# EAGLE design Breadboard (EAGLE 6.5.0)
AUTHOR: JP Liew; PRODUCT_NAME: STEMTera Breadboard; REV: V1.4
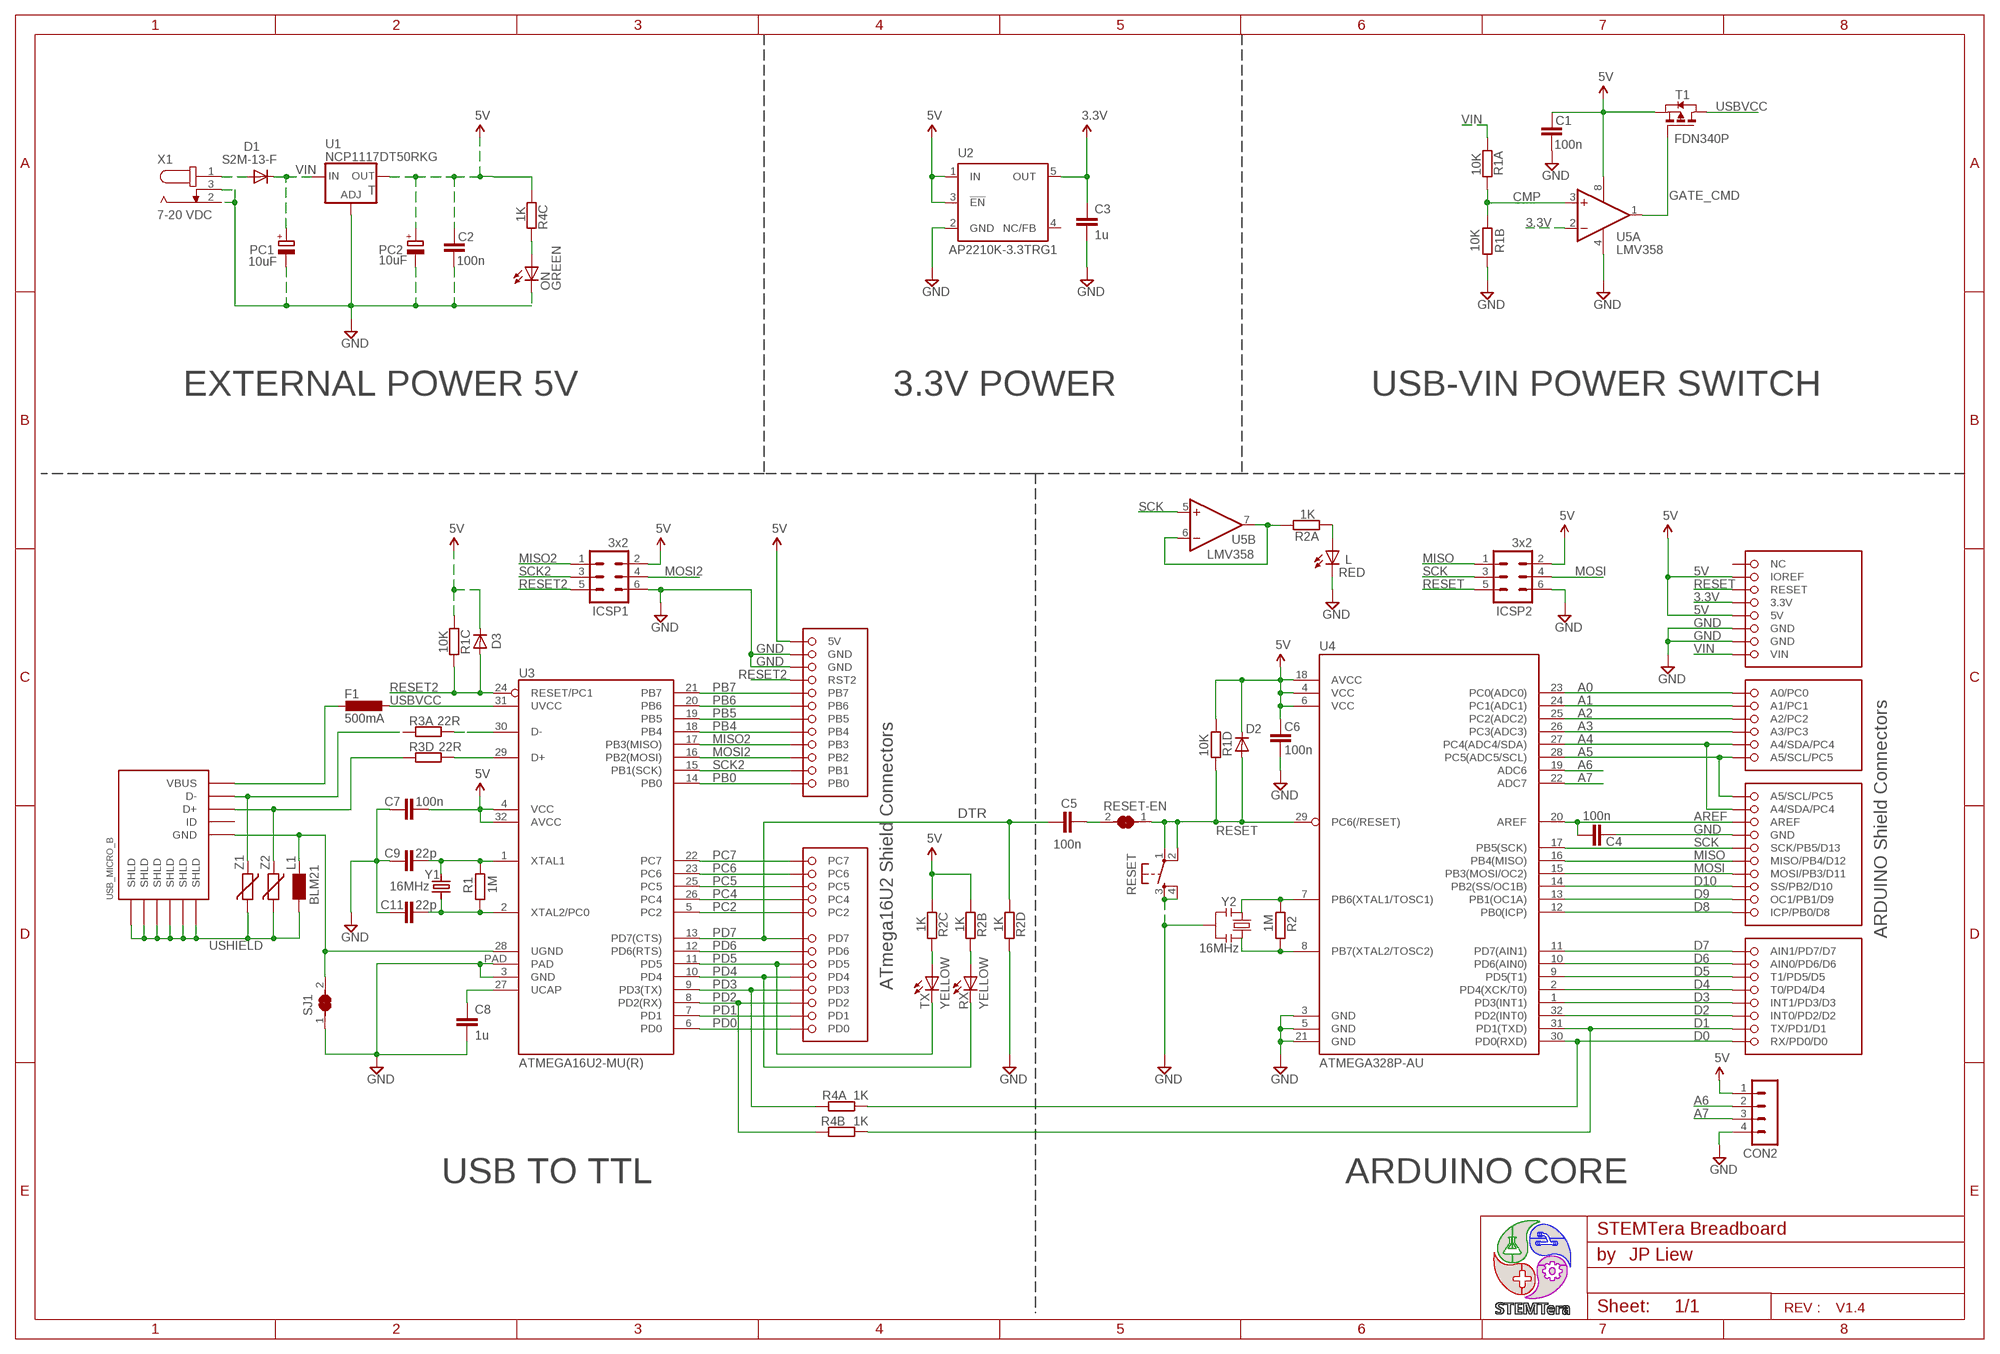
[diagram p0: schematic, sheet 1]

## Parts
C1  100n  C-EUC0603  [C0603]
C2  100n  C-EUC0603  [C0603]
C3  1u  C-EUC0603  [C0603]
C4  100n  C-EUC0603  [C0603]
C5  100n  C-EUC0603  [C0603]
C6  100n  C-EUC0603  [C0603]
C7  100n  C-EUC0603  [C0603]
C8  1u  C-EUC0603  [C0603]
C9  22p  C-EUC0603  [C0603]
C11  22p  C-EUC0603  [C0603]
CON1  STEMTERA  [STEMTERA]
CON2  MA04-1  [MA04-1-SMD]
D1  S2M-13-F  DIODE-SMB  [SMB]
D2  CD1206-S01575  DIODE-MINIMELF  [MINIMELF]
D3  CD1206-S01575  DIODE-MINIMELF  [MINIMELF]
F1  500mA  L-EUL1812  [L1812]
ICSP1  3x2  MA03-2  [MA03-2]
ICSP2  3x2  MA03-2  [MA03-2]
L  RED  LED3MM  [LED3MM]
L1  BLM21  WE-CBF-0805  [0805]
ON  GREEN  LED3MM  [LED3MM]
PC1  10uF  CAP_POL-CT6032  [CT6032]
PC2  10uF  CAP_POL-CT6032  [CT6032]
R1  1M  R-EU_R0603  [R0603]
R1A  10K  R-EU_R0603  [R0603]
R1B  10K  R-EU_R0603  [R0603]
R1C  10K  R-EU_R0603  [R0603]
R1D  10K  R-EU_R0603  [R0603]
R2  1M  R-EU_R0603  [R0603]
R2A  1K  R-EU_R0603  [R0603]
R2B  1K  R-EU_R0603  [R0603]
R2C  1K  R-EU_R0603  [R0603]
R2D  1K  R-EU_R0603  [R0603]
R3A  22R  R-EU_R0603  [R0603]
R3D  22R  R-EU_R0603  [R0603]
R4A  1K  R-EU_R0603  [R0603]
R4B  1K  R-EU_R0603  [R0603]
R4C  1K  R-EU_R0603  [R0603]
RESET  PUSH_BUTTON-ESWITCH_TL6120DF300QG  [PUSH_BUTTON-ESWITCH_TL6120DF300QG]
RESET-EN  Jumper  SOLDER_JUMPER_NC  [SOLDER_JUMPER_NC]
RX  YELLOW  LED3MM  [LED3MM]
SJ1  Jumper  SOLDER_JUMPER_NC  [SOLDER_JUMPER_NC]
T1  FDN340P  PMOSSOT23  [SOT-23]
TX  YELLOW  LED3MM  [LED3MM]
U1  NCP1117DT50RKG  LD117ADT-TR  [DPACK]
U2  AP2210K-3.3TRG1  TPS77001  [SOT23-DBV]
U3  ATMEGA16U2-MU(R)  ATMEGAXXU2-MU  [QFN32]
U4  ATMEGA328P-AU  ATMEGAXX8-32PIN  [TQFP32-7MM_0.8MM]
U5  LMV358  LM358-SO8  [SOIC08_3.8MM]
USB_MICRO_B  CONN_USB-FCI_10118193-0001LF  [CONN_USB_MICRO_B_10118193-0001LF]
X1  CONN_JACK-SINGLE_SIDED  [CONN_JACK_PJ-051A-SINGLE_SIDED]
Y1  16MHz  CRYSTAL-HC49US_2.5MM  [HC49US-SMD-2.5MM]
Y2  16MHz  RESONATORS-CSCTE_V  [CSTCE_V]
Z1  VARISTORCN0603  [CT/CN0603]
Z2  VARISTORCN0603  [CT/CN0603]

## Nets
3.3V: C3.1 CON1.3.3V U2.5(OUT) U5.2(A:-IN)
5V: C1.2 C2.2 C6.2 C7.2 CON1.5V CON1.5V@11(5V) CON1.IOREF CON2.1 D2.C D3.C ICSP1.2 ICSP2.2 PC2.+ R1C.2 R1D.2 R2B.2 R2C.2 R4C.2 T1.2(S) U1.4(OUT) U2.1(IN) U2.3(!EN) U3.4(VCC) U3.32(AVCC) U4.4(VCC) U4.6(VCC) U4.18(AVCC) U5.8(V+)
A0: CON1.A0(A0/PC0) U4.23(PC0(ADC0))
A1: CON1.A1(A1/PC1) U4.24(PC1(ADC1))
A2: CON1.A2(A2/PC2) U4.25(PC2(ADC2))
A3: CON1.A3(A3/PC3) U4.26(PC3(ADC3))
A4: CON1.A4@1(A4/SDA/PC4) CON1.A4@2(A4/SDA/PC4) U4.27(PC4(ADC4/SDA))
A5: CON1.A5@1(A5/SCL/PC5) CON1.A5@2(A5/SCL/PC5) U4.28(PC5(ADC5/SCL))
A6: CON2.2 U4.19(ADC6)
A7: CON2.3 U4.22(ADC7)
AREF: C4.2 CON1.AREF U4.20(AREF)
CMP: R1A.1 R1B.2 U5.3(A:+IN)
D0: CON1.D0(RX/PD0/D0) R4A.2 U4.30(PD0(RXD))
D1: CON1.D1(TX/PD1/D1) R4B.2 U4.31(PD1(TXD))
D2: CON1.D2(INT0/PD2/D2) U4.32(PD2(INT0))
D3: CON1.D3(INT1/PD3/D3) U4.1(PD3(INT1))
D4: CON1.D4(T0/PD4/D4) U4.2(PD4(XCK/T0))
D5: CON1.D5(T1/PD5/D5) U4.9(PD5(T1))
D6: CON1.D6(AIN0/PD6/D6) U4.10(PD6(AIN0))
D7: CON1.D7(AIN1/PD7/D7) U4.11(PD7(AIN1))
D8: CON1.D8(ICP/PB0/D8) U4.12(PB0(ICP))
D9: CON1.D9(OC1/PB1/D9) U4.13(PB1(OC1A))
D10: CON1.D10(SS/PB2/D10) U4.14(PB2(SS/OC1B))
GATE_CMD: T1.3(G) U5.1(A:OUT)
GND: C1.1 C2.1 C3.2 C4.1 C6.1 C7.1 C8.2 C9.1 C11.1 CON1.GND@1(GND) CON1.GND@2(GND) CON1.GND@3(GND) CON1.GND@11(GND) CON1.GND@12(GND) CON2.4 ICSP1.6 ICSP2.6 L.K(C) ON.K(C) PC1.- PC2.- R1B.1 R2D.1 RESET.3 RESET.4 SJ1.1 U1.1(ADJ) U2.2(GND) U3.3(GND) U3.PAD U4.3(GND) U4.5(GND) U4.21(GND) U5.4(V-) X1.2 X1.3 Y2.2
MISO: CON1.D12(MISO/PB4/D12) ICSP2.1 U4.16(PB4(MISO))
MISO2: CON1.PB3 ICSP1.1 U3.17(PB3(MISO))
MOSI: CON1.D11(MOSI/PB3/D11) ICSP2.4 U4.15(PB3(MOSI/OC2))
MOSI2: CON1.PB2 ICSP1.4 U3.16(PB2(MOSI))
N$1: R2.2 U4.7(PB6(XTAL1/TOSC1)) Y2.1
N$2: R3A.1 USB_MICRO_B.D- Z1.1
N$3: R3D.1 USB_MICRO_B.D+ Z2.1
N$4: C9.2 R1.2 U3.1(XTAL1) Y1.2
N$5: C8.1 U3.27(UCAP)
N$6: R3A.2 U3.30(D-)
N$7: C11.2 R1.1 U3.2(XTAL2/PC0) Y1.1
N$8: R3D.2 U3.29(D+)
N$9: R2.1 U4.8(PB7(XTAL2/TOSC2)) Y2.3
N$10: R2C.1 TX.A
N$11: R2B.1 RX.A
N$12: L.A R2A.2
N$13: D1.A X1.1
N$15: ON.A R4C.1
N$16: C5.2 RESET-EN.2
N$17: R2A.1 U5.6(B:-IN) U5.7(B:OUT)
PB0: CON1.PB0 U3.14(PB0)
PB4: CON1.PB4 U3.18(PB4)
PB5: CON1.PB5 U3.19(PB5)
PB6: CON1.PB6 U3.20(PB6)
PB7: CON1.PB7 U3.21(PB7)
PC2: CON1.PC2 U3.5(PC2)
PC4: CON1.PC4 U3.26(PC4)
PC5: CON1.PC5 U3.25(PC5)
PC6: CON1.PC6 U3.23(PC6)
PC7: CON1.PC7 U3.22(PC7)
PD0: CON1.PD0 U3.6(PD0)
PD1: CON1.PD1 U3.7(PD1)
PD2: CON1.PD2 R4B.1 U3.8(PD2(RX))
PD3: CON1.PD3 R4A.1 U3.9(PD3(TX))
PD4: CON1.PD4 RX.K(C) U3.10(PD4)
PD5: CON1.PD5 TX.K(C) U3.11(PD5)
PD6: CON1.PD6 U3.12(PD6(RTS))
PD7: C5.1 CON1.PD7 R2D.2 U3.13(PD7(CTS))
RESET: CON1.RESET D2.A ICSP2.5 R1D.1 RESET-EN.1 RESET.1 RESET.2 U4.29(PC6(/RESET))
RESET2: CON1.RST2 D3.A ICSP1.5 R1C.1 U3.24(RESET/PC1)
SCK: CON1.D13(SCK/PB5/D13) ICSP2.3 U4.17(PB5(SCK)) U5.5(B:+IN)
SCK2: CON1.PB1 ICSP1.3 U3.15(PB1(SCK))
UGND: L1.1 SJ1.2 U3.28(UGND) USB_MICRO_B.GND
USBVCC: F1.1 T1.1(D) U3.31(UVCC)
USHIELD: L1.2 USB_MICRO_B.SHLD@1(SHLD) USB_MICRO_B.SHLD@2(SHLD) USB_MICRO_B.SHLD@3(SHLD) USB_MICRO_B.SHLD@4(SHLD) USB_MICRO_B.SHLD@5(SHLD) USB_MICRO_B.SHLD@6(SHLD) Z1.2 Z2.2
VBUS: F1.2 USB_MICRO_B.VBUS
VIN: CON1.VIN D1.C PC1.+ R1A.2 U1.3(IN)
Unconnected: CON1.NC U2.4(NC/FB) USB_MICRO_B.ID

## Notes on the sheet
- 7-20 VDC
- EXTERNAL POWER 5V | 3.3V POWER | USB-VIN POWER SWITCH
- DTR
- ARDUINO Shield Connectors
- ATmega16U2 Shield Connectors
- USB TO TTL | ARDUINO CORE

## Library data of the parts
C1 C2 C4-C7 = rcl:C-EU: CAPACITOR, European symbol; DESCRIPTION: CAP CER 0.1UF 50V X7R 0603; MF: Yageo; MPN: CC0603KRX7R9BB104; OC_DIGIKEY: 311-1344-2-ND; URL: http://www.digikey.com/product-detail/en/CC0603KRX7R9BB104/311-1344-2-ND/2103082
C3 C8 = rcl:C-EU: CAPACITOR, European symbol; DESCRIPTION: CAP CER 1UF 10V X5R 0603; MF: Yageo; MPN: CC0603KRX5R6BB105; OC_DIGIKEY: 311-1443-2-ND; URL: http://www.digikey.com/product-detail/en/CC0603KRX5R6BB105/311-1443-2-ND/2833608
C9 C11 = rcl:C-EU: CAPACITOR, European symbol; DESCRIPTION: CAP CER 22PF 50V NP0 0603; MF: AVX; MPN: 06035A220JAT2A; OC_DIGIKEY: 478-1167-2-ND; URL: http://www.digikey.com/product-detail/en/06035A220JAT2A/478-1167-2-ND/563277
CON1 = SixthLogic:STEMTERA: STEMTera Layout; MF: NOT INSTALLED; MPN: NOT INSTALLED
CON2 = SixthLogic:MA04-1
D1 = diode:DIODE-: DIODE; DESCRIPTION: DIODE GEN PURP 1KV 1.5A SMB; MF: Diodes Inc; MPN: S2M-13-F; OC_DIGIKEY: S2M-FDITR-ND; URL: http://www.digikey.com/product-detail/en/S2M-13-F/S2M-FDITR-ND/749980
D2 D3 = diode:DIODE-: DIODE; DESCRIPTION: DIODE GEN PURP 100V 150MA 1206; MF: Bourns Inc; MPN: CD1206-S01575; OC_DIGIKEY: CD1206-S01575TR-ND; URL: http://www.digikey.com/product-detail/en/CD1206-S01575/CD1206-S01575TR-ND/3741981
F1 = rcl:L-EU: INDUCTOR, European symbol; DESCRIPTION: PTC RESETTABLE .50A 15V 1812; MF: Bourns Inc; MPN: MF-MSMF050-2; OC_DIGIKEY: MF-MSMF050-2TR-ND; URL: http://www.digikey.com/product-detail/en/MF-MSMF050-2/MF-MSMF050-2TR-ND/662816
ICSP1 = con-lstb:MA03-2: PIN HEADER; DESCRIPTION: ATmega16U2 ISP Conn; MF: NOT INSTALLED; MPN: NOT INSTALLED
ICSP2 = con-lstb:MA03-2: PIN HEADER; DESCRIPTION: ATmega328 ISP Conn; MF: NOT INSTALLED; MPN: NOT INSTALLED
L = led:LED: LED OSRAM: - CHIPLED LG R971, LG N971, LY N971, LG Q971, LY Q971, LO R971, LY R971 LH N974, LH R974 LS Q976, LO Q976, LY Q976 LO Q996 - Hyper CHIPLED LW Q18S LB Q993, LB Q99A, LB R99A - SideLED LS A670, LO A670, LY A670, LG A670, LP A670 LB A673, LV A673, LT A673, LW A673 LH A674 LY A675 LS A676, LA A676, LO A676, LY A676, LW A676 LS A679, LY A679, LG A679 - Hyper Micro SIDELED® LS Y876, LA Y876, LO Y876, LY Y876 LT Y87S - SmartLED LW L88C, LW L88S LB L89C, LB L89S, LG L890 LS L89K, LO L89K, LY L89K LS L896, LA L896, LO L896, LY L896 - TOPLED LS T670, LO T670, LY T670, LG T670, LP T670 LSG T670, LSP T670, LSY T670, LOP T670, LYG T670 LG T671, LOG T671, LSG T671 LB T673, LV T673, LT T673, LW T673 LH T674 LS T676, LA T676, LO T676, LY T676, LB T676, LH T676, LSB T676, LW T676 LB T67C, LV T67C, LT T67C, LS T67K, LO T67K, LY T67K, LW E67C LS E67B, LA E67B, LO E67B, LY E67B, LB E67C, LV E67C, LT E67C LW T67C LS T679, LY T679, LG T679 LS T770, LO T770, LY T770, LG T770, LP T770 LB T773, LV T773, LT T773, LW T773 LH T774 LS E675, LA E675, LY E675, LS T675 LS T776, LA T776, LO T776, LY T776, LB T776 LHGB T686 LT T68C, LB T68C - Hyper Mini TOPLED® LB M676 - Mini TOPLED Santana® LG M470 LS M47K, LO M47K, LY M47K Source: http://www.osram.convergy.de LUXEON: - LUMILED® LXK2-PW12-R00, LXK2-PW12-S00, LXK2-PW14-U00, LXK2-PW14-V00 LXK2-PM12-R00, LXK2-PM12-S00, LXK2-PM14-U00 LXK2-PE12-Q00, LXK2-PE12-R00, LXK2-PE12-S00, LXK2-PE14-T00, LXK2-PE14-U00 LXK2-PB12-K00, LXK2-PB12-L00, LXK2-PB12-M00, LXK2-PB14-N00, LXK2-PB14-P00, LXK2-PB14-Q00 LXK2-PR12-L00, LXK2-PR12-M00, LXK2-PR14-Q00, LXK2-PR14-R00 LXK2-PD12-Q00, LXK2-PD12-R00, LXK2-PD12-S00 LXK2-PH12-R00, LXK2-PH12-S00 LXK2-PL12-P00, LXK2-PL12-Q00, LXK2-PL12-R00 Source: www.luxeon.com KINGBRIGHT: KA-3528ASYC Source: www.kingbright.com; DESCRIPTION: LED, 2MM, RED, 8MCD, 617NM; MF: Kingbright; MPN: L-13ID; OC_NEWARK: 87W9950; URL: http://www.newark.com/kingbright/l-13id/led-2mm-red-8mcd-617nm/dp/87W9950?ost=l-13ID
L1 = SixthLogic:WE-CBF: SMD EMI Suppression Ferrite Beads - excellent anti-EMI properties - low DCR - impedances till 3000 ohms - rated current up to 6 A; DESCRIPTION: FERRITE CHIP 220 OHM 0805; MF: Murata; MPN: BLM21PG221SN1D; OC_DIGIKEY: 490-1054-2-ND; URL: http://www.digikey.com/product-detail/en/BLM21PG221SN1D/490-1054-2-ND/364909
ON = led:LED: LED OSRAM: - CHIPLED LG R971, LG N971, LY N971, LG Q971, LY Q971, LO R971, LY R971 LH N974, LH R974 LS Q976, LO Q976, LY Q976 LO Q996 - Hyper CHIPLED LW Q18S LB Q993, LB Q99A, LB R99A - SideLED LS A670, LO A670, LY A670, LG A670, LP A670 LB A673, LV A673, LT A673, LW A673 LH A674 LY A675 LS A676, LA A676, LO A676, LY A676, LW A676 LS A679, LY A679, LG A679 - Hyper Micro SIDELED® LS Y876, LA Y876, LO Y876, LY Y876 LT Y87S - SmartLED LW L88C, LW L88S LB L89C, LB L89S, LG L890 LS L89K, LO L89K, LY L89K LS L896, LA L896, LO L896, LY L896 - TOPLED LS T670, LO T670, LY T670, LG T670, LP T670 LSG T670, LSP T670, LSY T670, LOP T670, LYG T670 LG T671, LOG T671, LSG T671 LB T673, LV T673, LT T673, LW T673 LH T674 LS T676, LA T676, LO T676, LY T676, LB T676, LH T676, LSB T676, LW T676 LB T67C, LV T67C, LT T67C, LS T67K, LO T67K, LY T67K, LW E67C LS E67B, LA E67B, LO E67B, LY E67B, LB E67C, LV E67C, LT E67C LW T67C LS T679, LY T679, LG T679 LS T770, LO T770, LY T770, LG T770, LP T770 LB T773, LV T773, LT T773, LW T773 LH T774 LS E675, LA E675, LY E675, LS T675 LS T776, LA T776, LO T776, LY T776, LB T776 LHGB T686 LT T68C, LB T68C - Hyper Mini TOPLED® LB M676 - Mini TOPLED Santana® LG M470 LS M47K, LO M47K, LY M47K Source: http://www.osram.convergy.de LUXEON: - LUMILED® LXK2-PW12-R00, LXK2-PW12-S00, LXK2-PW14-U00, LXK2-PW14-V00 LXK2-PM12-R00, LXK2-PM12-S00, LXK2-PM14-U00 LXK2-PE12-Q00, LXK2-PE12-R00, LXK2-PE12-S00, LXK2-PE14-T00, LXK2-PE14-U00 LXK2-PB12-K00, LXK2-PB12-L00, LXK2-PB12-M00, LXK2-PB14-N00, LXK2-PB14-P00, LXK2-PB14-Q00 LXK2-PR12-L00, LXK2-PR12-M00, LXK2-PR14-Q00, LXK2-PR14-R00 LXK2-PD12-Q00, LXK2-PD12-R00, LXK2-PD12-S00 LXK2-PH12-R00, LXK2-PH12-S00 LXK2-PL12-P00, LXK2-PL12-Q00, LXK2-PL12-R00 Source: www.luxeon.com KINGBRIGHT: KA-3528ASYC Source: www.kingbright.com; DESCRIPTION: LED, GREEN, 2MM, 12MCD, 568NM; MF: Kingbright; MPN: L-13GD; OC_NEWARK: 85K7617; URL: http://www.newark.com/kingbright/l-13gd/led-green-2mm-12mcd-568nm/dp/85K7617?ost=l-13gd
PC1 PC2 = SixthLogic:CAP_POL: Capacitor with Polarity; DESCRIPTION: CAP TANT 10UF 25V 20%; MF: Kemet; MPN: T491C106M025AT7280; OC_DIGIKEY: 399-10160-2-ND; URL: http://www.digikey.com/product-detail/en/T491C106M025AT7280/399-10160-2-ND/3759639
R1 R2 = rcl:R-EU_: RESISTOR, European symbol; DESCRIPTION: RES SMD 1M OHM 1% 1/10W 0603; MF: Yageo; MPN: RC0603FR-071ML; OC_DIGIKEY: 311-1.00MHRTR-ND; URL: http://www.digikey.com/product-detail/en/RC0603FR-071ML/311-1.00MHRTR-ND/726844
R1A R1B R1C R1D = rcl:R-EU_: RESISTOR, European symbol; DESCRIPTION: RES SMD 10K OHM 1% 1/10W 0603; MF: Yageo; MPN: RC0603FR-0710KL; OC_DIGIKEY: 311-10.0KHRTR-ND; URL: http://www.digikey.com.au/product-detail/en/RC0603FR-0710KL/311-10.0KHRTR-ND/726880
R2A R2B R2C R2D R4A R4B R4C = rcl:R-EU_: RESISTOR, European symbol; DESCRIPTION: RES SMD 1K OHM 1% 1/10W 0603; MF: Yageo; MPN: RC0603FR-071KL; OC_DIGIKEY: 311-1.00KHRTR-ND; URL: http://www.digikey.com.au/product-detail/en/RC0603FR-071KL/311-1.00KHRTR-ND/726843
R3A R3D = rcl:R-EU_: RESISTOR, European symbol; DESCRIPTION: RES SMD 22 OHM 1% 1/10W 0603; MF: Yageo; MPN: RC0603FR-0722RL; OC_DIGIKEY: 311-22.0HRTR-ND; URL: http://www.digikey.com.au/product-detail/en/RC0603FR-0722RL/311-22.0HRTR-ND/727055
RESET = SixthLogic:PUSH_BUTTON: PUSH BUTTON; DESCRIPTION: SWITCH TACTILE SPST-NO 0.05A 50V; MF: E-Switch; MPN: TL6120DF300QG; OC_DIGIKEY: EG4356TR-ND; URL: http://www.digikey.com/product-detail/en/TL6120DF300QG/EG4356TR-ND/1137163
RESET-EN = SixthLogic:SOLDER_JUMPER_NC: Solder Jumper - Normally Closed; DESCRIPTION: RESET ENABLE PCB JUMPER; MF: NOT INSTALLED; MPN: NOT INSTALLED
RX = led:LED: LED OSRAM: - CHIPLED LG R971, LG N971, LY N971, LG Q971, LY Q971, LO R971, LY R971 LH N974, LH R974 LS Q976, LO Q976, LY Q976 LO Q996 - Hyper CHIPLED LW Q18S LB Q993, LB Q99A, LB R99A - SideLED LS A670, LO A670, LY A670, LG A670, LP A670 LB A673, LV A673, LT A673, LW A673 LH A674 LY A675 LS A676, LA A676, LO A676, LY A676, LW A676 LS A679, LY A679, LG A679 - Hyper Micro SIDELED® LS Y876, LA Y876, LO Y876, LY Y876 LT Y87S - SmartLED LW L88C, LW L88S LB L89C, LB L89S, LG L890 LS L89K, LO L89K, LY L89K LS L896, LA L896, LO L896, LY L896 - TOPLED LS T670, LO T670, LY T670, LG T670, LP T670 LSG T670, LSP T670, LSY T670, LOP T670, LYG T670 LG T671, LOG T671, LSG T671 LB T673, LV T673, LT T673, LW T673 LH T674 LS T676, LA T676, LO T676, LY T676, LB T676, LH T676, LSB T676, LW T676 LB T67C, LV T67C, LT T67C, LS T67K, LO T67K, LY T67K, LW E67C LS E67B, LA E67B, LO E67B, LY E67B, LB E67C, LV E67C, LT E67C LW T67C LS T679, LY T679, LG T679 LS T770, LO T770, LY T770, LG T770, LP T770 LB T773, LV T773, LT T773, LW T773 LH T774 LS E675, LA E675, LY E675, LS T675 LS T776, LA T776, LO T776, LY T776, LB T776 LHGB T686 LT T68C, LB T68C - Hyper Mini TOPLED® LB M676 - Mini TOPLED Santana® LG M470 LS M47K, LO M47K, LY M47K Source: http://www.osram.convergy.de LUXEON: - LUMILED® LXK2-PW12-R00, LXK2-PW12-S00, LXK2-PW14-U00, LXK2-PW14-V00 LXK2-PM12-R00, LXK2-PM12-S00, LXK2-PM14-U00 LXK2-PE12-Q00, LXK2-PE12-R00, LXK2-PE12-S00, LXK2-PE14-T00, LXK2-PE14-U00 LXK2-PB12-K00, LXK2-PB12-L00, LXK2-PB12-M00, LXK2-PB14-N00, LXK2-PB14-P00, LXK2-PB14-Q00 LXK2-PR12-L00, LXK2-PR12-M00, LXK2-PR14-Q00, LXK2-PR14-R00 LXK2-PD12-Q00, LXK2-PD12-R00, LXK2-PD12-S00 LXK2-PH12-R00, LXK2-PH12-S00 LXK2-PL12-P00, LXK2-PL12-Q00, LXK2-PL12-R00 Source: www.luxeon.com KINGBRIGHT: KA-3528ASYC Source: www.kingbright.com; DESCRIPTION: LED, 2MM, YELLOW, 8MCD, 588NM; MF: Kingbright; MPN: L-13YD; OC_NEWARK: 04M4239; URL: http://www.newark.com/kingbright/l-13yd/led-yellow-2mm-8mcd-590nm/dp/04M4239
SJ1 = SixthLogic:SOLDER_JUMPER_NC: Solder Jumper - Normally Closed; DESCRIPTION: USB SHIELD GROUND PCB JUMPER; MF: NOT INSTALLED; MPN: NOT INSTALLED
T1 = zetex:PMOSSOT23: MOS FET; DESCRIPTION: MOSFET P-CH 20V 2A SSOT3; MF: Fairchild; MPN: FDN340P; OC_DIGIKEY: FDN340PTR-ND; URL: http://www.digikey.com/product-detail/en/FDN340P/FDN340PTR-ND/965304
TX = led:LED: LED OSRAM: - CHIPLED LG R971, LG N971, LY N971, LG Q971, LY Q971, LO R971, LY R971 LH N974, LH R974 LS Q976, LO Q976, LY Q976 LO Q996 - Hyper CHIPLED LW Q18S LB Q993, LB Q99A, LB R99A - SideLED LS A670, LO A670, LY A670, LG A670, LP A670 LB A673, LV A673, LT A673, LW A673 LH A674 LY A675 LS A676, LA A676, LO A676, LY A676, LW A676 LS A679, LY A679, LG A679 - Hyper Micro SIDELED® LS Y876, LA Y876, LO Y876, LY Y876 LT Y87S - SmartLED LW L88C, LW L88S LB L89C, LB L89S, LG L890 LS L89K, LO L89K, LY L89K LS L896, LA L896, LO L896, LY L896 - TOPLED LS T670, LO T670, LY T670, LG T670, LP T670 LSG T670, LSP T670, LSY T670, LOP T670, LYG T670 LG T671, LOG T671, LSG T671 LB T673, LV T673, LT T673, LW T673 LH T674 LS T676, LA T676, LO T676, LY T676, LB T676, LH T676, LSB T676, LW T676 LB T67C, LV T67C, LT T67C, LS T67K, LO T67K, LY T67K, LW E67C LS E67B, LA E67B, LO E67B, LY E67B, LB E67C, LV E67C, LT E67C LW T67C LS T679, LY T679, LG T679 LS T770, LO T770, LY T770, LG T770, LP T770 LB T773, LV T773, LT T773, LW T773 LH T774 LS E675, LA E675, LY E675, LS T675 LS T776, LA T776, LO T776, LY T776, LB T776 LHGB T686 LT T68C, LB T68C - Hyper Mini TOPLED® LB M676 - Mini TOPLED Santana® LG M470 LS M47K, LO M47K, LY M47K Source: http://www.osram.convergy.de LUXEON: - LUMILED® LXK2-PW12-R00, LXK2-PW12-S00, LXK2-PW14-U00, LXK2-PW14-V00 LXK2-PM12-R00, LXK2-PM12-S00, LXK2-PM14-U00 LXK2-PE12-Q00, LXK2-PE12-R00, LXK2-PE12-S00, LXK2-PE14-T00, LXK2-PE14-U00 LXK2-PB12-K00, LXK2-PB12-L00, LXK2-PB12-M00, LXK2-PB14-N00, LXK2-PB14-P00, LXK2-PB14-Q00 LXK2-PR12-L00, LXK2-PR12-M00, LXK2-PR14-Q00, LXK2-PR14-R00 LXK2-PD12-Q00, LXK2-PD12-R00, LXK2-PD12-S00 LXK2-PH12-R00, LXK2-PH12-S00 LXK2-PL12-P00, LXK2-PL12-Q00, LXK2-PL12-R00 Source: www.luxeon.com KINGBRIGHT: KA-3528ASYC Source: www.kingbright.com; DESCRIPTION: LED, YELLOW, 2MM, 8MCD, 590NM; MF: Kingbright; MPN: L-13YD; OC_NEWARK: 04M4239; URL: http://www.newark.com/kingbright/l-13yd/led-yellow-2mm-8mcd-590nm/dp/04M4239
U1 = v-reg:LD117A?*: Low drop fixed and adjustable positive voltage regulators 1 A Source: http://www.st.com/stonline/products/literature/ds/7194/ld1117axx.pdf; DESCRIPTION: IC REG LDO 5V 1A DPAK; MF: ON Semiconductor; MPN: NCP1117DT50RKG; OC_DIGIKEY: NCP1117DT50RKGOSTR-ND; URL: http://www.digikey.com/product-detail/en/NCP1117DT50RKG/NCP1117DT50RKGOSTR-ND/661206
U2 = texas:TPS770*: ULTRALOW-POWER 50-mA LOW-DROPOUT LINEAR REGULATORS 50-mA Low-Dropout Regulator Source: http://focus.ti.com/lit/ds/symlink/tps77001.pdf; DESCRIPTION: IC REG LDO 3.3V 0.3A SOT25; MF: Diodes Inc; MPN: AP2210K-3.3TRG1; OC_DIGIKEY: AP2210K-3.3TRG1DITR-ND; URL: http://www.digikey.com/product-detail/en/AP2210K-3.3TRG1/AP2210K-3.3TRG1DITR-ND/4470819
U3 = SixthLogic:ATMEGAXXU2: ATmegaXXU2 8-bit Microcontroller with 8/16/32K Bytes of ISP Flash and USB Controller; DESCRIPTION: IC MCU 8BIT 16KB FLASH 32QFN; MF: Atmel; MPN: ATMEGA16U2-MU; OC_DIGIKEY: ATMEGA16U2-MU-ND; URL: http://www.digikey.com/product-detail/en/ATMEGA16U2-MU/ATMEGA16U2-MU-ND/2050821
U4 = SixthLogic:ATMEGAXX8-32PIN; DESCRIPTION: IC MCU 8BIT 32KB FLASH 32TQFP; MF: Atmel; MPN: ATmega328P-AUR; OC_DIGIKEY: ATMEGA328P-AURTR-ND; URL: http://www.digikey.com/product-detail/en/ATMEGA328P-AUR/ATMEGA328P-AURTR-ND/2357086
U5 = SixthLogic:LM358: LM358 OPAMP; DESCRIPTION: IC OPAMP GP 1MHZ RRO 8SOP; MF: Diodes Incorporated; MPN: LMV358SG-13; OC_DIGIKEY: LMV358SG-13DITR-ND; URL: http://www.digikey.com/product-detail/en/LMV358SG-13/LMV358SG-13DITR-ND/2182560
USB_MICRO_B = SixthLogic:CONN_USB: USB Connector; DESCRIPTION: Connector Receptacle USB - micro B 2.0 5 Position Surface Mount, Right Angle, Horizontal; MF: FCI; MPN: 10118193-0001LF; OC_DIGIKEY: 609-4616-2-ND; URL: http://www.digikey.com/product-detail/en/10118193-0001LF/609-4616-2-ND/2785388
X1 = SixthLogic:CONN_JACK: DC POWER JACK; DESCRIPTION: CON PWR JCK 2.0 X 6.0MM W/SHLD; MF: CUI Inc; MPN: PJ-051A; OC_DIGIKEY: CP-051A-ND; URL: http://www.digikey.com.au/product-detail/en/PJ-051A/CP-051A-ND/1644585
Y1 = SixthLogic:CRYSTAL: 2 pin Crystal; DESCRIPTION: Crystal 16.0000MHz 20ppm 18pF; MF: Abracon; MPN: ABLS3-16.000MHZ-D4Y-T; OC_DIGIKEY: 535-10856-2-ND; URL: https://www.digikey.com.au/product-detail/en/ABLS3-16.000MHZ-D4Y-T/535-10856-2-ND/2623698
Y2 = SixthLogic:RESONATORS: Ceramic Resonators; DESCRIPTION: CER RESONATOR 16.0MHZ SMD; MF: Murata; MPN: CSTCE16M0V53-R0; OC_DIGIKEY: 490-1198-2-ND; URL: http://www.digikey.com/product-detail/en/CSTCE16M0V53-R0/490-1198-2-ND/584406
Z1 Z2 = varistor:VARISTOR: VARISTOR; DESCRIPTION: VARISTOR 0603; MF: Bourns Inc; MPN: CG0603MLC-05E; OC_DIGIKEY: CG0603MLC-05ETR-ND; URL: http://www.digikey.com/product-detail/en/CG0603MLC-05E/CG0603MLC-05ETR-ND/2538084

## Board
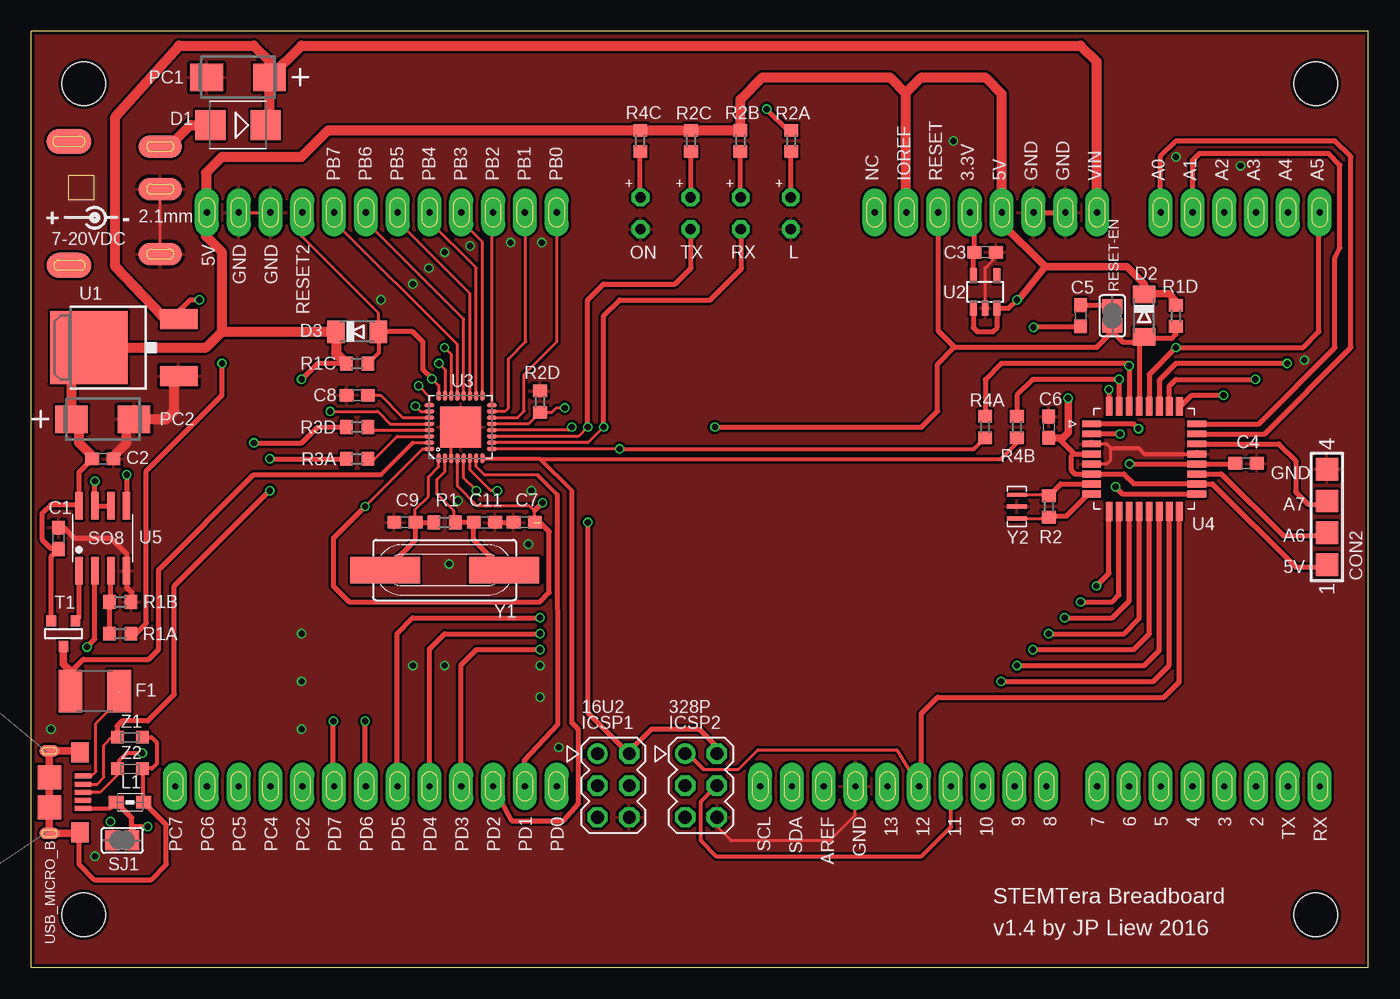
[diagram p1: board, top side]
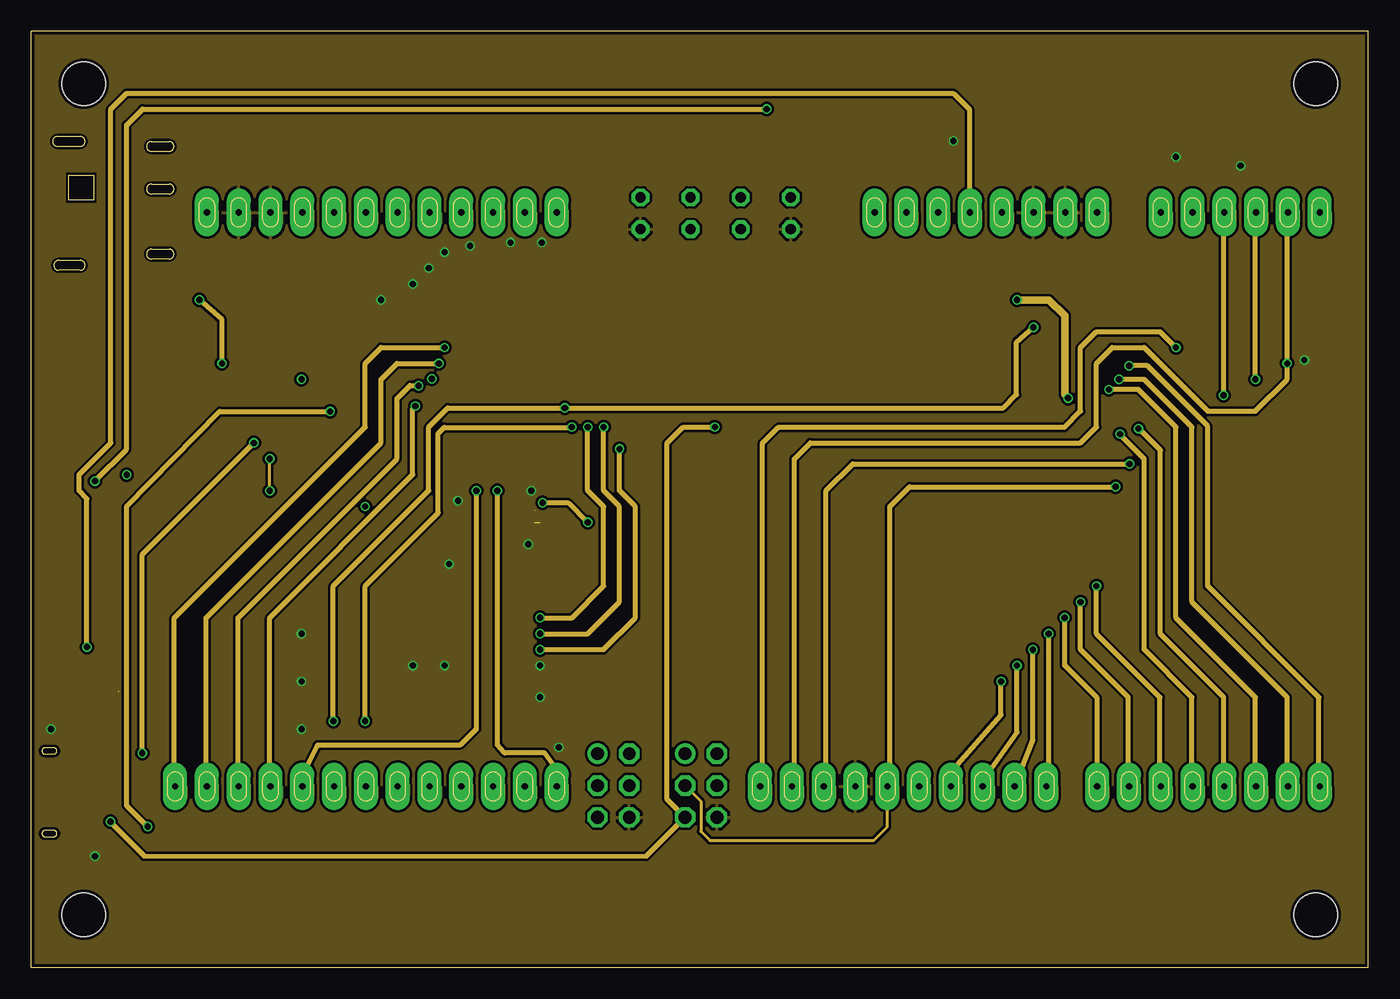
[diagram p2: board, inner layer Route2]
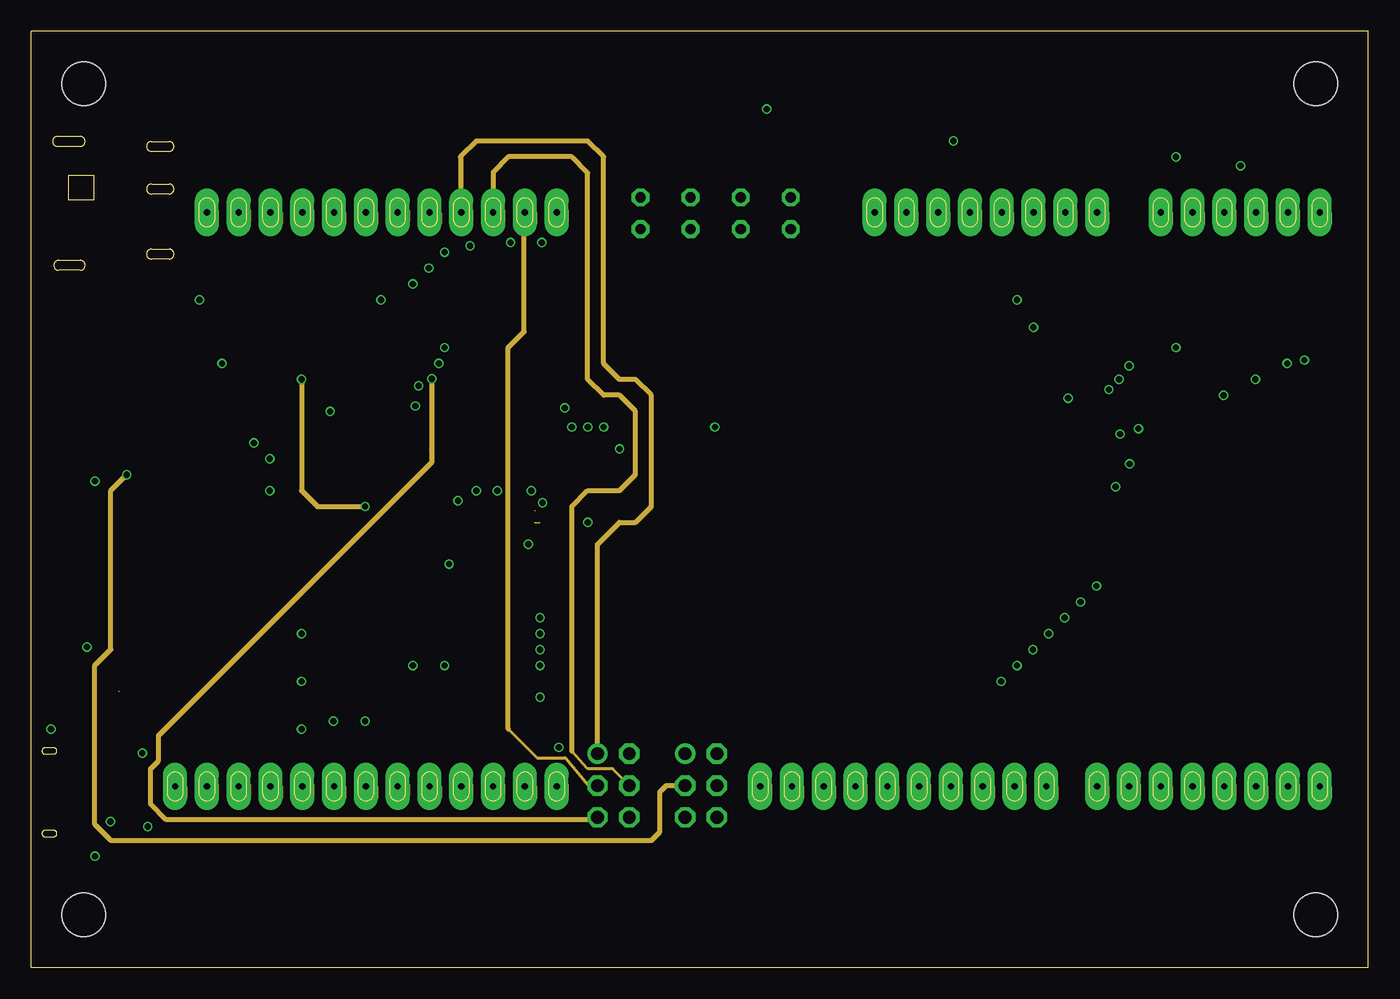
[diagram p3: board, inner layer Route3]
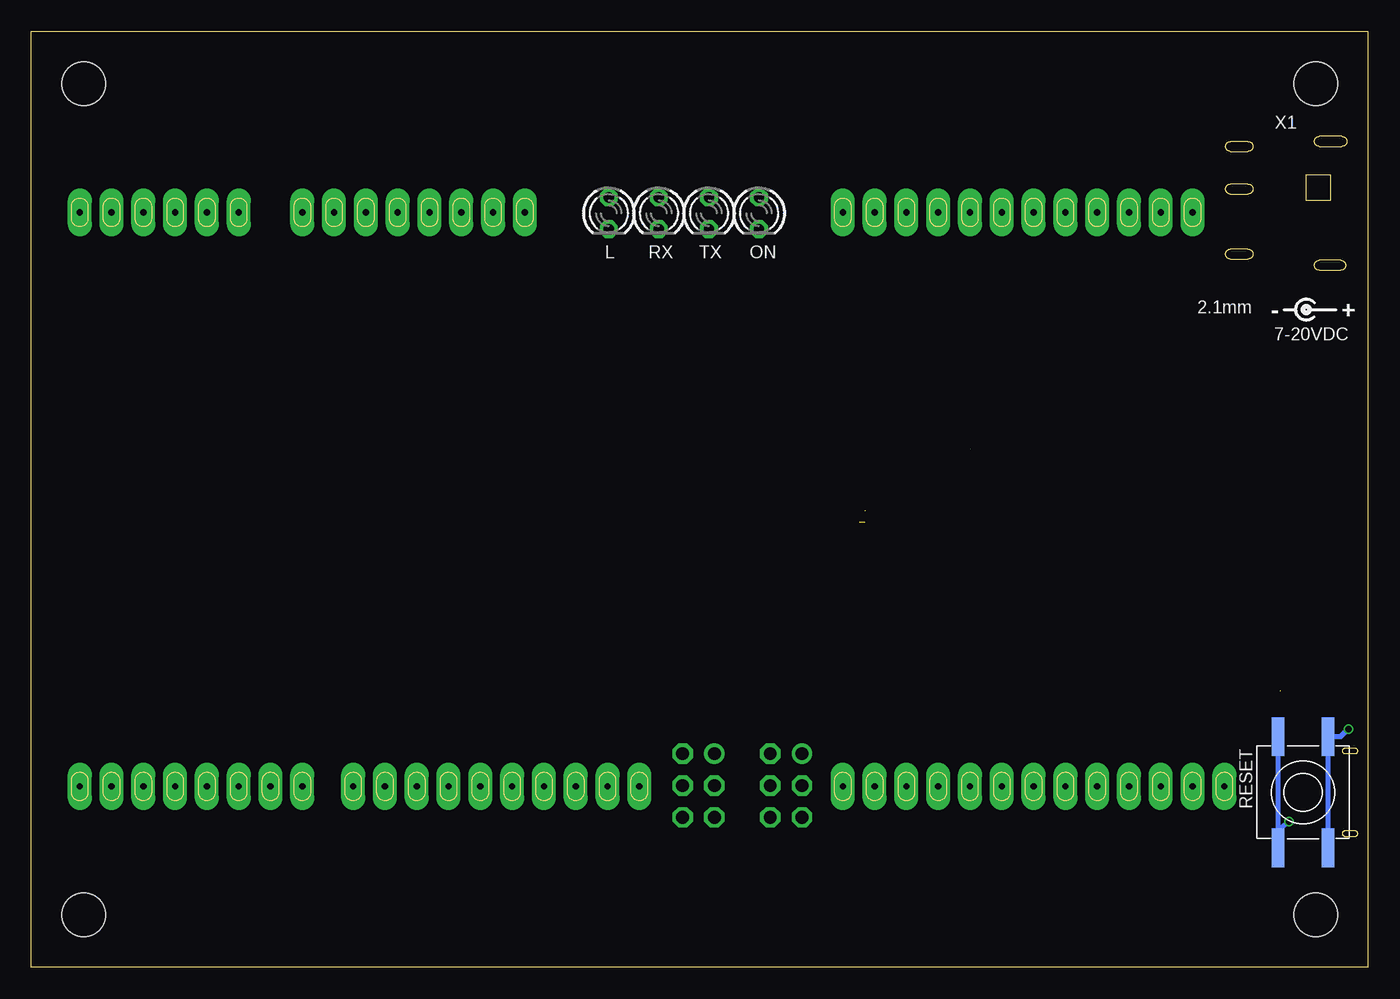
[diagram p4: board, bottom side, seen from below]

Size 106.8 x 74.8 mm. Coordinates in mm from the lower left corner, seen from the top.
Copper layers ((1*2+3)*16): Top 0.0356mm / dielectric 0.1702mm / Route2 0.0178mm / dielectric 47mil / Route3 0.0178mm / dielectric 0.1702mm / Bottom 0.0356mm
Design rules "GeekAmmo *": minimum track width 8mil, minimum drill 0.2mm, track to track 0.2mm, track to pad 0.2mm, pad to pad 0.2mm, via to via 0.2mm, smd to smd 0.2mm, copper to edge 10mil, drill to drill 8mil, minimum pad ring 12mil, minimum via ring 4mil, stop-mask expansion 3mil, vias tented up to drill 25mil, thermal gap 10mil

### Footprints (pad centres in the part's own frame; a part is rotated, then mirrored left to right if it is on the bottom)
C0603 = smd 1.1 x 1: 1 -0.85,0; 2 0.85,0
STEMTERA = drill 0.5 pad 1.9 long: 3.3V 74.99,60.33; 5V 77.53,60.33; 5V@11 14.03,60.33; A0 90.23,60.33; A1 92.77,60.33; A2 95.31,60.33; A3 97.85,60.33; A4@1 100.39,60.33; A4@2 60.766,14.47; A5@1 102.93,60.33; A5@2 58.226,14.47; AREF 63.306,14.47; D0 102.93,14.47; D1 100.39,14.47; D2 97.85,14.47; D3 95.31,14.47; D4 92.77,14.47; D5 90.23,14.47; D6 87.69,14.47; D7 85.15,14.47; D8 81.086,14.47; D9 78.546,14.47; D10 76.006,14.47; D11 73.466,14.47; D12 70.926,14.47; D13 68.386,14.47; GND@1 80.07,60.33; GND@2 82.61,60.33; GND@3 65.846,14.47; GND@11 19.11,60.33; GND@12 16.57,60.33; IOREF 69.91,60.33; NC 67.37,60.33; PB0 41.97,60.33; PB1 39.43,60.33; PB2 36.89,60.33; PB3 34.35,60.33; PB4 31.81,60.33; PB5 29.27,60.33; PB6 26.73,60.33; PB7 24.19,60.33; PC2 21.65,14.47; PC4 19.11,14.47; PC5 16.57,14.47; PC6 14.03,14.47; PC7 11.49,14.47; PD0 41.97,14.47; PD1 39.43,14.47; PD2 36.89,14.47; PD3 34.35,14.47; PD4 31.81,14.47; PD5 29.27,14.47; PD6 26.73,14.47; PD7 24.19,14.47; RESET 72.45,60.33; RST2 21.65,60.33; VIN 85.15,60.33 | hole 3.5: 4.2,4.2; 102.6,4.2; 102.6,70.6; 4.2,70.6
MA04-1-SMD = smd 1.778 x 1.778: 1 -3.81,0; 2 -1.27,0; 3 1.27,0; 4 3.81,0
SMB = smd 2.4 x 2.4: A 2.2,0; C -2.2,0
MINIMELF = smd 1.4 x 1.8: A 1.7,0; C -1.7,0
L1812 = smd 1.9 x 3.4: 1 -1.95,0; 2 1.95,0
MA03-2 = drill 1.016: 1 -2.54,-1.27 | drill 1.016 octagon: 2 -2.54,1.27; 3 0,-1.27; 4 0,1.27; 5 2.54,-1.27; 6 2.54,1.27
LED3MM = drill 0.813 octagon: A -1.27,0; K 1.27,0
0805 = smd 1.2 x 1: 1 -1.1,0; 2 1.1,0
CT6032 = smd 2.6 x 2.2: + -2.5,0; - 2.5,0
R0603 = smd 1 x 1.1: 1 -0.85,0; 2 0.85,0
PUSH_BUTTON-ESWITCH_TL6120DF300QG = smd 3.1 x 1: 1 -4.45,-2; 2 4.45,-2; 3 -4.45,2; 4 4.45,2
SOLDER_JUMPER_NC = smd 1.168 x 1.6: 1 -0.762,0; 2 0.762,0
SOT-23 = smd 0.787 x 0.889: 1 0.025,-1.016; 2 -0.94,1.016; 3 0.991,1.016
DPACK = smd 1.6 x 3: 1 -2.28,-4.8; 3 2.28,-4.8 | smd 5.8 x 6.2: 4 0,2.38
SOT23-DBV = smd 0.55 x 1.2: 1 -0.95,-1.3; 2 0,-1.3; 3 0.95,-1.3; 4 0.95,1.3; 5 -0.95,1.3
QFN32 = smd 0.3 x 0.8: 1 -1.75,-2.5; 2 -1.25,-2.5; 3 -0.75,-2.5; 4 -0.25,-2.5; 5 0.25,-2.5; 6 0.75,-2.5; 7 1.25,-2.5; 8 1.75,-2.5; 17 1.75,2.5; 18 1.25,2.5; 19 0.75,2.5; 20 0.25,2.5; 21 -0.25,2.5; 22 -0.75,2.5; 23 -1.25,2.5; 24 -1.75,2.5 | smd 0.8 x 0.3: 9 2.5,-1.75; 10 2.5,-1.25; 11 2.5,-0.75; 12 2.5,-0.25; 13 2.5,0.25; 14 2.5,0.75; 15 2.5,1.25; 16 2.5,1.75; 25 -2.5,1.75; 26 -2.5,1.25; 27 -2.5,0.75; 28 -2.5,0.25; 29 -2.5,-0.25; 30 -2.5,-0.75; 31 -2.5,-1.25; 32 -2.5,-1.75 | smd 3.3 x 3.3: PAD 0,0
TQFP32-7MM_0.8MM = smd 1.5 x 0.55: 1 -4.2,2.8; 2 -4.2,2; 3 -4.2,1.2; 4 -4.2,0.4; 5 -4.2,-0.4; 6 -4.2,-1.2; 7 -4.2,-2; 8 -4.2,-2.8; 17 4.2,-2.8; 18 4.2,-2; 19 4.2,-1.2; 20 4.2,-0.4; 21 4.2,0.4; 22 4.2,1.2; 23 4.2,2; 24 4.2,2.8 | smd 0.55 x 1.5: 9 -2.8,-4.2; 10 -2,-4.2; 11 -1.2,-4.2; 12 -0.4,-4.2; 13 0.4,-4.2; 14 1.2,-4.2; 15 2,-4.2; 16 2.8,-4.2; 25 2.8,4.2; 26 2,4.2; 27 1.2,4.2; 28 0.4,4.2; 29 -0.4,4.2; 30 -1.2,4.2; 31 -2,4.2; 32 -2.8,4.2
SOIC08_3.8MM = smd 0.6 x 2.2: 1 -1.905,-2.6; 2 -0.635,-2.6; 3 0.635,-2.6; 4 1.905,-2.6; 5 1.905,2.6; 6 0.635,2.6; 7 -0.635,2.6; 8 -1.905,2.6
CONN_USB_MICRO_B_10118193-0001LF = smd 0.4 x 1.35: D+ 0,4.125; D- -0.65,4.125; GND 1.3,4.125; ID 0.65,4.125; VBUS -1.3,4.125 | smd 1.9 x 1.9: SHLD@1 -1.2,1.45; SHLD@2 1.2,1.45 | smd 1.6 x 1.4: SHLD@3 -3.2,3.9; SHLD@4 3.2,3.9 | smd 0.9 x 1.6: SHLD@5 -3.3,1.45; SHLD@6 3.3,1.45
CONN_JACK_PJ-051A-SINGLE_SIDED = smd 3.5 x 1.8 bottom: 1 10.3,-3.3; 2 10.3,5.3; 3 10.3,0.1 | smd 3.6 x 2 bottom: SHLD@1 3,6.2; SHLD@2 3,-3.7
HC49US-SMD-2.5MM = smd 5.6 x 2.1: 1 -4.75,0; 2 4.75,0
CSTCE_V = smd 0.3 x 1.6: 1 -0.95,0; 2 0,0; 3 0.95,0
CT/CN0603 = smd 1 x 1: 1 -1,0; 2 1,0

### Placement (x,y rotation side)
C1  2.18,34.29 270 top
C2  5.71,40.64 180 top
C3  76.2,57.15 0 top
C4  97.04,40.28 180 top
C5  83.82,52.07 90 top
C6  81.28,43.18 270 top
C7  39.37,35.56 0 top
C8  26.04,45.72 180 top
C9  29.84,35.56 0 top
C11  36.2,35.56 180 top
CON1  0,0 0 top
CON2  103.5,36 90 top
D1  16.51,67.31 180 top
D2  88.9,52.07 270 top
D3  26.04,50.8 0 top
F1  5.08,22.09 0 top
ICSP1  46.5,14.54 270 top
ICSP2  53.5,14.54 270 top
L  60.67,60.26 270 bottom
L1  7.89,13.2 0 top
ON  48.67,60.26 270 bottom
PC1  16.51,71.12 180 top
PC2  5.71,43.81 0 top
R1  33.02,35.56 180 top
R1A  7.11,26.67 0 top
R1B  7.11,29.21 180 top
R1C  26.04,48.26 180 top
R1D  91.44,52.07 90 top
R2  81.28,36.83 90 top
R2A  60.71,66.04 270 top
R2B  56.64,66.04 90 top
R2C  52.7,66.04 90 top
R2D  40.64,45.21 270 top
R3A  26.04,40.64 0 top
R3D  26.04,43.18 0 top
R4A  76.2,43.18 90 top
R4B  78.74,43.18 90 top
R4C  48.64,66.04 90 top
RESET  5.2,14 270 bottom
RESET-EN  86.36,52.07 90 top
RX  56.67,60.26 270 bottom
SJ1  7.26,10.16 0 top
T1  2.54,26.67 0 top
TX  52.67,60.26 270 bottom
U1  6.99,49.53 90 top
U2  76.2,53.98 0 top
U3  34.29,43.18 0 top
U4  88.9,40.64 0 top
U5  5.71,34.29 0 top
USB_MICRO_B  0,14 270 top
X1  0,62.3 180 bottom
Y1  33.02,31.75 180 top
Y2  78.74,36.83 270 top
Z1  7.89,18.39 0 top
Z2  7.89,15.88 0 top

### Tracks (layer width: path | path; a pad name or v marks a point on that pad's centre or on a via)
3.3V  (via drill 0.5 layers 1-3)
  Top 0.406: U5.2 5.08,26.24 v4.45,25.6 | U2.5 75.25,57.05 C3.1 75.35,59.97 CON1.3.3V
  Route2 0.406: v4.45,25.6 4.45,37.47 3.81,38.1 3.81,39.37 6.35,41.91 6.35,68.58 7.62,69.85 73.66,69.85 74.93,68.58 74.93,60.39 CON1.3.3V
  Route2 1.9: 74.99,61.28 CON1.3.3V 74.99,59.38
  Route3 1.9: 74.99,61.28 CON1.3.3V 74.99,59.38
5V  (via drill 0.5 layers 1-3)  (3 unrouted)
  Top 0.254: v26.67,36.83 31.27,41.43 U3.32 | C7.2 40.21,35.57 40.21,36.47 39.8,36.88 35.61,36.88 34.04,38.45 U3.4
  Top 0.305: 93.08,38.66 U4.18 | 91.44,53.24 R1D.2 | 88.95,53.82 D2.C 88.9,54.15 | 81.29,42.32 C6.2 82.02,42.33
  Top 0.406: 83.31,41.04 U4.4 | 83.31,41.04 83.06,40.79 83.06,39.75 83.37,39.44 U4.6 87.28,39.44 88.06,38.66 93.08,38.66 | U5.8 3.81,36.83 | U5.8 3.81,39.59 C2.2 | T1.2 1.6,32.86 C1.2 1.61,33.44 0.89,34.16 0.89,36.32 1.57,37.01 3.69,37.01 U5.8 | 82.02,42.33 83.31,41.04 | ICSP2.2 54.61,17.24 54.61,17.78 53.34,19.05 49.53,19.05 47.77,17.29 ICSP1.2 44.45,20.4 v44.45,35.56 | 40.22,36.51 v40.84,37.13 | 40.64,35.56 41.38,34.82 41.38,29.95 40.64,29.21 25.4,29.21 24.13,30.48 24.13,34.29 v26.67,36.83 | R1C.2 22.86,48.26 v21.59,46.99 | U2.1 75.25,51.12 75.56,50.8 76.83,50.8 77.17,51.13 77.17,52.66 U2.3 78.08,52.67 v78.74,53.34 | U4.18 94.36,38.64 101,32 103.31,32 CON2.1
  Top 0.61: 91.44,53.24 90.86,53.82 88.95,53.82 | v82.83,45.49 82.83,42.75 82.4,42.32 81.29,42.32 | D2.C 88.9,54.61 87.51,56 80.99,56 | CON1.5V 77.47,60.27 77.47,59.52 80.99,56 | v78.74,53.34 78.84,53.34 80.99,56
  Top 0.813: 15.24,50.8 13.97,49.53 U1.4 3.21,48.14 PC2.+ 3.81,43.22 3.81,41.91 4.87,40.85 C2.2 | 15.24,50.8 15.24,57.15 13.97,58.42 13.97,60.27 CON1.5V@11 13.97,60.39 13.97,63.5 15.24,64.77 21.59,64.77 23.71,66.89 R4C.2 R2C.2 R2B.2 56.64,69.34 58.42,71.12 68.58,71.12 69.85,69.85 | R1C.2 24.34,49.11 D3.C 15.24,50.8 | 69.85,69.85 69.85,60.39 CON1.IOREF | 69.85,69.85 71.12,71.12 76.2,71.12 77.53,69.79 CON1.5V
  Route2 0.305: 82.55,45.8 v82.83,45.49
  Route2 0.406: v40.84,37.13 42.88,37.13 v44.45,35.56
  Route2 0.61: v78.74,53.34 81.28,53.34 82.55,52.07 82.55,45.8
  Route2 1.9: 77.53,61.28 CON1.5V 77.53,59.38 | 14.03,61.28 CON1.5V@11 14.03,59.38 | 69.91,61.28 CON1.IOREF 69.91,59.38
  Route3 0.406: v21.59,46.99 21.59,38.1 22.86,36.83 v26.67,36.83
  Route3 1.9: 77.53,61.28 CON1.5V 77.53,59.38 | 14.03,61.28 CON1.5V@11 14.03,59.38 | 69.91,61.28 CON1.IOREF 69.91,59.38
A0
  Top 0.406: U4.23 98.52,42.64 105.41,49.53 105.41,64.77 104.14,66.04 91.44,66.04 90.17,64.77 90.17,60.39 CON1.A0
  Route2 1.9: 90.23,61.28 CON1.A0 90.23,59.38
  Route3 1.9: 90.23,61.28 CON1.A0 90.23,59.38
A1
  Top 0.406: U4.24 98.05,43.44 104.14,49.53 104.14,56.72 104.55,57.51 104.55,64.11 103.63,65.02 93.29,65.02 92.73,64.47 92.73,60.37 CON1.A1
  Route2 1.9: 92.77,61.28 CON1.A1 92.77,59.38
  Route3 1.9: 92.77,61.28 CON1.A1 92.77,59.38
A2  (via drill 0.5 layers 1-3)
  Top 0.254: U4.25 91.83,44.84
  Top 0.406: 91.83,44.84 92.71,45.72 v95.25,45.72
  Route2 0.406: v95.25,45.72 95.25,60.27 CON1.A2
  Route2 1.9: 95.31,61.28 CON1.A2 95.31,59.38
  Route3 1.9: 95.31,61.28 CON1.A2 95.31,59.38
A3  (via drill 0.5 layers 1-3)
  Top 0.406: U4.26 90.9,46.45 91.44,46.99 v97.79,46.99
  Route2 0.406: v97.79,46.99 97.79,60.27 CON1.A3
  Route2 1.9: 97.85,61.28 CON1.A3 97.85,59.38
  Route3 1.9: 97.85,61.28 CON1.A3 97.85,59.38
A4  (via drill 0.5 layers 1-3)
  Top 0.406: U4.27 90.1,46.92 91.44,48.26 v100.33,48.26
  Route2 0.406: CON1.A4@1 100.33,60.27 v100.33,48.26 100.33,46.99 97.79,44.45 93.98,44.45 88.9,49.53 86.36,49.53 85.09,48.26 85.09,43.18 83.82,41.91 62.23,41.91 60.96,40.64 60.96,14.66 CON1.A4@2
  Route2 1.9: 100.39,61.28 CON1.A4@1 100.39,59.38 | 60.77,15.42 CON1.A4@2 60.77,13.52
  Route3 1.9: 100.39,61.28 CON1.A4@1 100.39,59.38 | 60.77,15.42 CON1.A4@2 60.77,13.52
A5  (via drill 0.5 layers 1-3)
  Top 0.406: U4.28 89.3,47.39 v91.44,49.53 101.6,49.53 102.87,50.8 102.87,60.27 CON1.A5@1
  Route2 0.406: v91.44,49.53 90.17,50.8 85.09,50.8 83.82,49.53 83.82,44.45 82.55,43.18 59.69,43.18 58.42,41.91 58.42,14.66 CON1.A5@2
  Route2 1.9: 102.93,61.28 CON1.A5@1 102.93,59.38 | 58.23,15.42 CON1.A5@2 58.23,13.52
  Route3 1.9: 102.93,61.28 CON1.A5@1 102.93,59.38 | 58.23,15.42 CON1.A5@2 58.23,13.52
A6
  Top 0.406: U4.19 95.06,39.44 100,34.5 103.27,34.5 CON2.2
A7
  Top 0.406: U4.22 99.66,41.84 101,40.5 101,38 102,37 103.23,37 CON2.3
AREF  (via drill 0.5 layers 1-3)
  Top 0.254: v87.73,40.23 v87.74,40.24
  Top 0.406: v87.74,40.24 U4.20 96.15,40.24 C4.2
  Route2 0.406: v87.73,40.23 65.63,40.23 63.5,38.1 63.5,14.66 CON1.AREF
  Route2 1.9: 63.31,15.42 CON1.AREF 63.31,13.52
  Route3 1.9: 63.31,15.42 CON1.AREF 63.31,13.52
CMP
  Top 0.305: R1B.2 6.35,29.3
  Top 0.406: 6.35,29.3 U5.3 | R1A.1 R1B.2
D0  (via drill 0.5 layers 1-3)
  Top 0.254: v87.71,48.08 v87.7,48.08
  Top 0.406: v87.7,48.08 U4.30 | R4A.2 76.2,46.99 77.47,48.26 87.53,48.26 v87.71,48.08
  Route2 0.406: v87.71,48.08 89.15,48.08 93.98,43.26 93.98,30.48 102.87,21.59 102.87,14.53 CON1.D0
  Route2 1.9: 102.93,15.42 CON1.D0 102.93,13.52
  Route3 1.9: 102.93,15.42 CON1.D0 102.93,13.52
D1  (via drill 0.5 layers 1-3)
  Top 0.406: R4B.2 78.74,45.72 80.01,46.99 v86.89,46.99 v86.9,46.98 U4.31
  Route2 0.406: v86.89,46.99 88.9,46.99 92.71,43.18 92.71,29.21 100.33,21.59 100.33,14.53 CON1.D1
  Route2 1.9: 100.39,15.42 CON1.D1 100.39,13.52
  Route3 1.9: 100.39,15.42 CON1.D1 100.39,13.52
D2  (via drill 0.5 layers 1-3)
  Top 0.254: v86.08,46.18 86.1,46.34
  Top 0.406: 86.1,46.34 U4.32
  Route2 0.406: v86.08,46.18 88.44,46.18 91.44,43.18 91.44,27.94 97.79,21.59 97.79,14.53 CON1.D2
  Route2 1.9: 97.85,15.42 CON1.D2 97.85,13.52
  Route3 1.9: 97.85,15.42 CON1.D2 97.85,13.52
D3  (via drill 0.5 layers 1-3)
  Top 0.406: U4.1 88.06,43.44 v88.44,43.05
  Route2 0.254: 88.47,43.05 v88.44,43.05
  Route2 0.406: 88.47,43.05 90.19,41.33 90.19,26.64 95.25,21.59 95.25,14.53 CON1.D3
  Route2 1.9: 95.31,15.42 CON1.D3 95.31,13.52
  Route3 1.9: 95.31,15.42 CON1.D3 95.31,13.52
D4  (via drill 0.5 layers 1-3)
  Top 0.254: v86.97,42.62 86.9,42.64
  Top 0.406: 86.9,42.64 U4.2
  Route2 0.254: 86.97,42.57 v86.97,42.62
  Route2 0.406: 86.97,42.57 88.9,40.64 88.9,25.4 92.71,21.59 92.71,14.53 CON1.D4
  Route2 1.9: 92.77,15.42 CON1.D4 92.77,13.52
  Route3 1.9: 92.77,15.42 CON1.D4 92.77,13.52
D5  (via drill 0.5 layers 1-3)
  Top 0.406: U4.9 86.1,31.49 v85.09,30.48
  Route2 0.406: v85.09,30.48 85.09,26.67 90.17,21.59 90.17,14.53 CON1.D5
  Route2 1.9: 90.23,15.42 CON1.D5 90.23,13.52
  Route3 1.9: 90.23,15.42 CON1.D5 90.23,13.52
D6  (via drill 0.5 layers 1-3)
  Top 0.406: U4.10 86.9,29.75 86.36,29.21 v83.82,29.21
  Route2 0.406: v83.82,29.21 83.82,25.4 87.63,21.59 87.63,14.53 CON1.D6
  Route2 1.9: 87.69,15.42 CON1.D6 87.69,13.52
  Route3 1.9: 87.69,15.42 CON1.D6 87.69,13.52
D7  (via drill 0.5 layers 1-3)
  Top 0.406: U4.11 87.7,29.28 86.36,27.94 v82.55,27.94
  Route2 0.406: 85.15,15.42 85.15,21.53 82.55,24.13 v82.55,27.94
  Route2 1.9: 85.15,15.42 CON1.D7 85.15,13.52
  Route3 1.9: 85.15,15.42 CON1.D7 85.15,13.52
D8  (via drill 0.5 layers 1-3)
  Top 0.406: U4.12 88.5,27.87 87.3,26.67 v81.28,26.67
  Route2 0.406: v81.28,26.67 81.28,14.66 CON1.D8
  Route2 1.9: 81.09,15.42 CON1.D8 81.09,13.52
  Route3 1.9: 81.09,15.42 CON1.D8 81.09,13.52
D9  (via drill 0.5 layers 1-3)
  Top 0.406: U4.13 89.33,26.66 88.06,25.4 v80.01,25.4
  Route2 0.406: v80.01,25.4 80.01,18.22 CON1.D9
  Route2 1.9: 78.55,15.42 CON1.D9 78.55,13.52
  Route3 1.9: 78.55,15.42 CON1.D9 78.55,13.52
D10  (via drill 0.5 layers 1-3)
  Top 0.406: U4.14 90.1,25.33 88.9,24.13 v78.74,24.13
  Route2 0.406: v78.74,24.13 78.74,18.8 76.2,15.24 76.2,14.66 CON1.D10
  Route2 1.9: 76.01,15.42 CON1.D10 76.01,13.52
  Route3 1.9: 76.01,15.42 CON1.D10 76.01,13.52
GATE_CMD
  Top 0.305: T1.3 3.81,27.96
  Top 0.406: 3.81,27.96 U5.1
GND  (via drill 0.5, 0.5 layers 1-3)
  Top 0.254: U4.3 85.92,41.84 86.23,41.53 86.23,40.51 85.98,40.26 84.72,40.26 U4.5 | ICSP2.6 54.77,11.27 55.88,10.16 63.94,10.16 63.94,10.27 65.81,12.14 65.81,14.44 CON1.GND@3 | X1.2 X1.3 | CON1.GND@12 CON1.GND@11 | U3.3 33.54,42.43 U3.PAD | U2.2 76.2,55.88 76.83,56.52 76.83,56.94 C3.2
  Top 0.305: U4.21 88.93,41.04 88.47,41.5 86.26,41.5 86.23,41.53 | 8.03,29.27 R1B.1
  Top 0.406: 8.89,62.23 10.27,62.23 X1.3 | C1.1 2.6,35.14 3.43,34.31 6.33,34.31 7.62,33.02 U5.4 7.62,30.38 8.03,29.97 8.03,29.27 | C11.1 C7.1 | CON1.GND@1 CON1.GND@2 | U3.PAD 35.05,43.18 35.05,42.34
  Top 0.813: U1.1 11.43,46.9 11.43,44.45 10.79,43.81 PC2.- 7.62,43.22 7.62,41.91 6.57,40.85 C2.1
  Route2 1.9: 80.07,61.28 CON1.GND@1 80.07,59.38 | 82.61,61.28 CON1.GND@2 82.61,59.38 | 65.85,15.42 CON1.GND@3 65.85,13.52 | 19.11,61.28 CON1.GND@11 19.11,59.38 | 16.57,61.28 CON1.GND@12 16.57,59.38
  Route3 1.9: 80.07,61.28 CON1.GND@1 80.07,59.38 | 82.61,61.28 CON1.GND@2 82.61,59.38 | 65.85,15.42 CON1.GND@3 65.85,13.52 | 19.11,61.28 CON1.GND@11 19.11,59.38 | 16.57,61.28 CON1.GND@12 16.57,59.38
  Bottom 0.406: RESET.4 RESET.3 2.17,18.45 v1.57,19.05
  other vias: 39.7,33.81 5.08,8.89 21.59,26.67 33.02,24.13 27.94,53.34 30.48,54.61 31.75,55.88 33.02,57.15 35.05,57.66 91.44,64.77 96.6,64.06 33.38,32.23 21.59,22.86 21.59,19.05 30.48,24.13 40.64,24.13 40.64,21.59 34.09,37.29 73.66,66.04 39.95,38.1 42.14,17.59 38.29,57.92 40.79,57.92 101.7,48.53
  pour Top: 0,74.93 0,0 106.68,0 106.68,74.93
  pour Route2: -0.1,74.9 -0.1,-0.1 106.9,-0.1 106.9,74.9
MISO
  Top 0.254: 53.7,15.85 56.49,15.85 58.04,17.4 69.14,17.4 CON1.D12
  Top 0.305: ICSP2.1 52.47,17.08 53.7,15.85
  Top 0.406: U4.16 91.7,22.82 90.47,21.59 72.39,21.59 71.12,20.32 71.12,14.66 CON1.D12
  Route2 1.9: 70.93,15.42 CON1.D12 70.93,13.52
  Route3 1.9: 70.93,15.42 CON1.D12 70.93,13.52
MISO2
  Top 0.254: U3.17 36.04,57.94 34.29,59.69 34.29,60.27 CON1.PB3
  Route2 1.9: 34.35,61.28 CON1.PB3 34.35,59.38
  Route3 0.406: ICSP1.1 45.23,33.8 46.99,35.56 48.26,35.56 49.53,36.83 49.53,45.72 48.26,46.99 46.99,46.99 45.72,48.26 45.72,64.77 44.45,66.04 35.56,66.04 34.29,64.77 34.29,60.39 CON1.PB3
  Route3 1.9: 34.35,61.28 CON1.PB3 34.35,59.38
MOSI  (via drill 0.5 layers 1-3)
  Top 0.305: CON1.D11 73.47,11.24 71.12,8.89 54.71,8.89 53.52,10.13 53.52,13.26 ICSP2.4
  Top 0.406: U4.15 90.9,24.15 89.64,22.86 v77.47,22.86
  Route2 0.406: v77.47,22.86 77.47,20.19 73.66,15.88 73.66,14.66 CON1.D11
  Route2 1.9: 73.47,15.42 CON1.D11 73.47,13.52
  Route3 1.9: 73.47,15.42 CON1.D11 73.47,13.52
MOSI2
  Top 0.254: U3.16 36.79,60.23 CON1.PB2
  Route2 1.9: 36.89,61.28 CON1.PB2 36.89,59.38
  Route3 0.254: 43.18,17.27 44.45,15.88 46.44,15.88 ICSP1.4
  Route3 0.406: 43.18,17.27 43.18,36.83 44.45,38.1 46.99,38.1 48.26,39.37 48.26,44.45 46.99,45.72 45.72,45.72 44.45,46.99 44.45,63.5 43.18,64.77 38.1,64.77 36.89,63.56 36.89,61.28
  Route3 1.9: 36.89,61.28 CON1.PB2 36.89,59.38
N$1
  Top 0.254: Y2.1 81.18,37.78 R2.2
  Top 0.406: U4.7 82.24,38.64 R2.2
N$2  (via drill 0.5 layers 1-3)
  Top 0.254: USB_MICRO_B.D- 5.25,14.65 5.8,15.2 5.8,17.75 6.5,18.5 6.78,18.5 Z1.1
  Top 0.406: v19.05,38.1 11.43,30.48 11.43,21.83 9.3,19.7 7.25,19.7 6.85,19.3 6.85,18.43 Z1.1 | v19.05,40.64 R3A.1
  Route2 0.254: v19.05,38.1 v19.05,40.64
N$3  (via drill 0.5 layers 1-3)
  Top 0.254: Z2.1 6.89,15.39 5.5,14 USB_MICRO_B.D+
  Top 0.305: v8.87,17.12 7.62,17.12 7,16.5 7,15.98 Z2.1
  Top 0.406: v17.78,41.91 21.59,41.91 22.86,43.18 R3D.1
  Route2 0.406: v8.87,17.12 8.87,32.99 v17.78,41.91
N$4
  Top 0.254: U3.1 32.54,40.01 31.73,39.19 31.73,37.64 30.66,36.58 30.66,35.6 C9.2
  Top 0.406: R1.2 C9.2 30.7,34.17 Y1.2
N$5
  Top 0.254: U3.27 29.68,43.93 27.89,45.72 C8.1
N$6
  Top 0.254: U3.30 29.22,42.43 27.43,40.64 R3A.2
N$7
  Top 0.254: U3.2 33.04,39.62 32.41,38.99 32.41,37.82 33.76,36.47 33.76,35.67 R1.1
  Top 0.406: R1.1 C11.2 35.34,34.17 Y1.1
N$8
  Top 0.254: U3.29 27.14,42.93 R3D.2
N$9
  Top 0.254: Y2.3 81.18,35.88 R2.1 81.37,36.07 | 84.45,37.84 U4.8
  Top 0.406: 84.45,37.84 82.68,36.07 81.37,36.07
N$10
  Top 0.406: R2C.1 52.7,61.56 TX.A
N$11
  Top 0.406: R2B.1 56.64,61.56 RX.A
N$12
  Top 0.406: R2A.2 60.71,61.57 L.A
N$13
  Top 0.813: X1.1 10.99,65.6 12.7,67.31 D1.A
N$14
  cutout Route2: 1.5,66 arc-90 2.1,66.6 3.9,66.6 arc-90 4.5,66 arc-90 3.9,65.4 2.1,65.4 arc-90
N$15
  Top 0.406: R4C.1 48.64,61.56 ON.A
N$16
  Top 0.305: 86.27,52.92 RESET-EN.2
  Top 0.406: C5.2 86.27,52.92
N$17  (via drill 0.5 layers 1-3)
  Top 0.406: U5.6 U5.7 v5.08,38.86 | R2A.1 60.44,66.89 v58.75,68.58
  Route2 0.406: v58.75,68.58 8.89,68.58 7.62,67.31 7.62,41.4 v5.08,38.86
N$18
  cutout Route2: 2.8,63.5 2.8,61.1 5.2,61.1 5.2,63.5
N$19
  cutout Route2: 1.6,56.1 arc-90 2.2,56.7 3.9,56.7 arc-90 4.5,56.1 arc-90 3.9,55.5 2.2,55.5 arc-90
N$20
  cutout Route2: 9,65.6 arc-90 9.6,66.2 11,66.2 arc-90 11.6,65.6 arc-90 11,65 9.6,65 arc-90
N$21
  cutout Route2: 9,62.2 arc-90 9.6,62.8 11,62.8 arc-90 11.6,62.2 arc-90 11,61.6 9.6,61.6 arc-90
N$22
  cutout Route2: 9,57 arc-90 9.6,57.6 11,57.6 arc-90 11.6,57 arc-90 11,56.4 9.6,56.4 arc-90
N$23
  cutout Route2: 0.6,17.3 arc-90 1.1,17.8 1.8,17.8 arc-90 2.3,17.3 arc-90 1.8,16.8 1.1,16.8 arc-90
N$24
  cutout Route2: 0.6,10.7 arc-90 1.1,11.2 1.8,11.2 arc-90 2.3,10.7 arc-90 1.8,10.2 1.1,10.2 arc-90
PB0
  Top 0.254: U3.14 38.85,43.93 39.37,44.45 39.37,47.37 42,50 42,60.3 CON1.PB0
  Route2 1.9: 41.97,61.28 CON1.PB0 41.97,59.38
  Route3 1.9: 41.97,61.28 CON1.PB0 41.97,59.38
PB4
  Top 0.254: U3.18 35.54,55.9 31.75,59.69 31.75,60.27 CON1.PB4
  Route2 1.9: 31.81,61.28 CON1.PB4 31.81,59.38
  Route3 1.9: 31.81,61.28 CON1.PB4 31.81,59.38
PB5
  Top 0.254: U3.19 35.04,53.86 29.21,59.69 29.21,60.27 CON1.PB5
  Route2 1.9: 29.27,61.28 CON1.PB5 29.27,59.38
  Route3 1.9: 29.27,61.28 CON1.PB5 29.27,59.38
PB6
  Top 0.254: U3.20 34.54,51.82 26.67,59.69 26.67,60.27 CON1.PB6
  Route2 1.9: 26.73,61.28 CON1.PB6 26.73,59.38
  Route3 1.9: 26.73,61.28 CON1.PB6 26.73,59.38
PB7
  Top 0.254: U3.21 34.04,49.78 24.13,59.69 24.13,60.27 CON1.PB7
  Route2 1.9: 24.19,61.28 CON1.PB7 24.19,59.38
  Route3 1.9: 24.19,61.28 CON1.PB7 24.19,59.38
PC2  (via drill 0.5 layers 1-3)
  Top 0.254: U3.5 34.54,39.12 v35.56,38.1
  Route2 0.406: v35.56,38.1 35.56,19.05 34.29,17.8 22.86,17.78 21.59,15.24 21.59,14.53 CON1.PC2
  Route2 1.9: 21.65,15.42 CON1.PC2 21.65,13.52
  Route3 1.9: 21.65,15.42 CON1.PC2 21.65,13.52
PC4  (via drill 0.5 layers 1-3)
  Top 0.254: U3.26 31.11,44.43 v30.68,44.86
  Route2 0.406: v30.68,44.86 30.48,44.65 30.48,39.37 19.05,27.94 19.05,14.53 CON1.PC4
  Route2 1.9: 19.11,15.42 CON1.PC4 19.11,13.52
  Route3 1.9: 19.11,15.42 CON1.PC4 19.11,13.52
PC5  (via drill 0.5 layers 1-3)
  Top 0.254: U3.25 31.79,45.63 v30.94,46.48
  Route2 0.406: v30.94,46.48 30.91,46.51 30.25,46.51 29.21,45.47 29.21,40.64 16.51,27.94 16.51,14.53 CON1.PC5
  Route2 1.9: 16.57,15.42 CON1.PC5 16.57,13.52
  Route3 1.9: 16.57,15.42 CON1.PC5 16.57,13.52
PC6  (via drill 0.5 layers 1-3)
  Top 0.254: U3.23 33.04,47.78 v32.56,48.26
  Route2 0.406: v32.56,48.26 29.21,48.26 27.94,46.99 27.94,41.91 13.97,27.94 13.97,14.53 CON1.PC6
  Route2 1.9: 14.03,15.42 CON1.PC6 14.03,13.52
  Route3 1.9: 14.03,15.42 CON1.PC6 14.03,13.52
PC7  (via drill 0.5 layers 1-3)
  Top 0.254: U3.22 33.54,49.01 v33.02,49.53
  Route2 0.406: v33.02,49.53 27.94,49.53 26.67,48.26 26.67,43.18 11.43,27.94 11.43,14.53 CON1.PC7
  Route2 1.9: 11.49,15.42 CON1.PC7 11.49,13.52
  Route3 1.9: 11.49,15.42 CON1.PC7 11.49,13.52
PD0  (via drill 0.5 layers 1-3)
  Top 0.254: U3.6 35.04,39.76 36.7,38.1 v37.24,38.1
  Route2 0.406: v37.24,38.1 37.24,17.78 37.82,17.14 41.02,17.14 41.91,15.88 41.91,14.53 CON1.PD0
  Route2 1.9: 41.97,15.42 CON1.PD0 41.97,13.52
  Route3 1.9: 41.97,15.42 CON1.PD0 41.97,13.52
PD1
  Top 0.254: U3.7 35.54,40.02 36.22,39.34 40.46,39.34
  Top 0.305: 42.04,37.77 40.46,39.34
  Top 0.406: 42.04,37.77 42.06,19.41 39.37,16.51 39.37,14.53 CON1.PD1
  Route2 1.9: 39.43,15.42 CON1.PD1 39.43,13.52
  Route3 1.9: 39.43,15.42 CON1.PD1 39.43,13.52
PD2
  Top 0.254: 78.74,41.91 R4B.1 | 36.08,40.64 U3.8
  Top 0.305: 78.74,41.91 77.47,40.64 40.64,40.64 | 40.64,40.64 36.08,40.64 | 43.18,38.1 40.64,40.64
  Top 0.406: 43.18,38.1 43.18,19.56 43.71,19.02 43.71,13.06 42.52,11.73 38.37,11.73 CON1.PD2
  Route2 1.9: 36.89,15.42 CON1.PD2 36.89,13.52
  Route3 1.9: 36.89,15.42 CON1.PD2 36.89,13.52
PD3  (via drill 0.5 layers 1-3)
  Top 0.254: v46.99,41.43 U3.9
  Top 0.305: v46.99,41.43 75.3,41.43 R4A.1
  Top 0.406: CON1.PD3 34.35,24.19 35.56,25.4 v40.64,25.4
  Route2 0.406: v40.64,25.4 45.72,25.4 48.26,27.94 48.26,36.83 46.99,38.1 v46.99,41.43
  Route2 1.9: 34.35,15.42 CON1.PD3 34.35,13.52
  Route3 1.9: 34.35,15.42 CON1.PD3 34.35,13.52
PD4  (via drill 0.5 layers 1-3)
  Top 0.254: U3.10 44.47,41.93 v45.72,43.18
  Top 0.406: v45.72,43.18 45.72,52.07 46.99,53.34 54.23,53.34 56.74,55.85 56.74,58.92 RX.K | CON1.PD4 31.81,25.46 33.02,26.67 v40.64,26.67
  Route2 0.406: v40.64,26.67 44.45,26.67 46.99,29.21 46.99,36.83 45.72,38.1 v45.72,43.18
  Route2 1.9: 31.81,15.42 CON1.PD4 31.81,13.52
  Route3 1.9: 31.81,15.42 CON1.PD4 31.81,13.52
PD5  (via drill 0.5 layers 1-3)
  Top 0.254: U3.11 43.7,42.43 v44.45,43.18
  Top 0.406: v44.45,43.18 44.45,53.34 45.72,54.61 51.44,54.61 52.7,55.88 52.7,58.95 TX.K | v40.64,27.94 30.48,27.94 29.21,26.67 29.21,14.53 CON1.PD5
  Route2 0.406: v40.64,27.94 43.18,27.94 45.72,30.48 45.72,36.83 44.45,38.1 v44.45,43.18
  Route2 1.9: 29.27,15.42 CON1.PD5 29.27,13.52
  Route3 1.9: 29.27,15.42 CON1.PD5 29.27,13.52
PD6  (via drill 0.5 layers 1-3)
  Top 0.254: U3.12 42.93,42.93 v43.18,43.18
  Top 0.406: v26.67,19.68 26.67,14.53 CON1.PD6
  Route2 0.406: v26.67,19.68 26.67,30.48 32.51,36.32 32.51,42.7 32.54,42.7 32.99,43.16 43.16,43.16 v43.18,43.18
  Route2 1.9: 26.73,15.42 CON1.PD6 26.73,13.52
  Route3 1.9: 26.73,15.42 CON1.PD6 26.73,13.52
PD7  (via drill 0.5 layers 1-3)
  Top 0.254: v80.06,51.16 80.12,51.22 | U3.13 39.71,43.43 R2D.2 40.68,44.32 41.55,44.32 41.94,44.7 v42.62,44.7
  Top 0.406: 80.12,51.22 C5.1 | v24.13,19.68 24.13,14.53 CON1.PD7
  Route2 0.406: v80.06,51.16 78.72,49.96 78.72,45.77 77.65,44.7 v42.62,44.7 33.27,44.7 31.75,43.18 31.75,38.1 24.13,30.48 v24.13,19.68
  Route2 1.9: 24.19,15.42 CON1.PD7 24.19,13.52
  Route3 1.9: 24.19,15.42 CON1.PD7 24.19,13.52
RESET  (via drill 0.5, 0.5 layers 1-3)
  Top 0.254: 88.5,49.97 D2.A
  Top 0.305: D2.A 88.98,50.29
  Top 0.406: R1D.1 91.44,50.6 91.14,50.29 88.98,50.29 | v54.61,43.18 71.12,43.18 72.39,44.45 72.39,48.18 73.76,49.55 | U4.29 88.5,49.97 87.19,49.97 86.36,50.8 | 86.36,50.8 RESET-EN.1 | 86.36,50.8 85.09,49.53 85.06,49.55 73.76,49.55 | CON1.RESET 72.45,50.87 73.76,49.55
  Route2 0.305: v6.33,11.66 6.35,11.61
  Route2 0.406: v54.61,43.18 52.07,43.18 50.8,41.91 50.8,13.43 ICSP2.5 49.12,8.89 9.02,8.91 6.35,11.61
  Route2 1.9: 72.45,61.28 CON1.RESET 72.45,59.38
  Route3 1.9: 72.45,61.28 CON1.RESET 72.45,59.38
  Bottom 0.406: RESET.2 7.2,10.99 | 7.2,10.99 RESET.1 | 7.2,10.99 v6.33,11.66
RESET2  (via drill 0.5 layers 1-3)
  Top 0.254: D3.A 27.73,52.27 21.59,58.42 21.59,60.27 CON1.RST2 | U3.24 32.54,46.51 v32,47.04
  Top 0.305: D3.A 27.73,49.11 R1C.1
  Top 0.406: v32,47.04 31.29,47.75 31.29,49.99 30.48,50.8 D3.A
  Route2 1.9: 21.65,61.28 CON1.RST2 21.65,59.38
  Route3 0.406: v32,47.04 32,40.39 10.16,18.54 10.16,16.51 9.53,15.88 9.53,13.08 10.79,11.81 45.16,11.81 ICSP1.5
  Route3 1.9: 21.65,61.28 CON1.RST2 21.65,59.38
SCK  (via drill 0.5 layers 1-3)
  Top 0.406: U4.17 87.18,37.84 v86.61,38.41 | v7.62,39.37 U5.5
  Route2 0.254: ICSP2.3 53.49,13.28 53.49,10.87 54.2,10.16 67.31,10.16 68.39,11.24 68.39,13.52
  Route2 0.406: v86.61,38.41 70.16,38.41 68.58,36.83 68.58,14.66 CON1.D13
  Route2 1.9: 68.39,15.42 CON1.D13 68.39,13.52
  Route3 0.406: ICSP2.3 50.73,14.54 50.22,14.02 50.22,10.85 49.53,10.16 6.35,10.16 5.08,11.43 5.08,24.13 6.35,25.4 6.35,38.1 v7.62,39.37
  Route3 1.9: 68.39,15.42 CON1.D13 68.39,13.52
SCK2
  Top 0.254: U3.15 37.85,44.43 38.12,44.7 38.12,48.62 39.5,50 39.5,60.26 CON1.PB1
  Route2 1.9: 39.43,61.28 CON1.PB1 39.43,59.38
  Route3 0.254: 38.1,19.05 40.39,16.76 42.67,16.76 44.52,14.54 ICSP1.3
  Route3 0.406: 38.1,19.05 38.1,49.53 39.37,50.8 39.37,60.27 CON1.PB1
  Route3 1.9: 39.43,61.28 CON1.PB1 39.43,59.38
UGND  (via drill 0.5 layers 1-3)
  Top 0.254: U3.28 28.68,43.43 27.69,44.42 v23.88,44.42
  Top 0.305: USB_MICRO_B.GND 6.29,12.7 L1.1
  Top 0.406: v9.3,11.25 8.25,11.25 8.03,11.03 SJ1.2 8.03,11.96 L1.1
  Route2 0.406: v23.88,44.42 15.06,44.42 7.62,36.83 7.62,12.93 v9.3,11.25
USBVCC
  Top 0.254: 30.5,41.93 U3.31
  Top 0.305: 27.94,39.37 30.5,41.93
  Top 0.406: 27.94,39.37 17.78,39.37 10.16,31.75 10.16,25.4 9.39,24.63 4.16,24.63 3.17,23.65
  Top 0.61: T1.1 2.56,24.26 3.17,23.65 3.17,21.64 F1.1
USHIELD
  Top 0.305: Z1.2 9.61,18.39 10,18 10,16.25 9.65,15.9 8.91,15.9 Z2.2 8.89,13.3 L1.2
  Top 0.406: USB_MICRO_B.SHLD@4 3.81,10.71 3.81,8.26 5.08,6.99 9.53,6.99 10.79,8.26 10.79,11.39 L1.2
  Top 0.61: USB_MICRO_B.SHLD@3 3.8,17.3 USB_MICRO_B.SHLD@5 USB_MICRO_B.SHLD@1 USB_MICRO_B.SHLD@2 USB_MICRO_B.SHLD@6 3.8,10.7 USB_MICRO_B.SHLD@4
VBUS  (1 unrouted)
  Top 0.254: USB_MICRO_B.VBUS 4.8,15.3 5.15,15.65 5.15,19.5 7,21.35 7,22.06
VIN  (via drill 0.5 layers 1-3)
  Top 0.254: R1A.2 8.36,26.67 | 11.43,52.07 11.53,52.07
  Top 0.406: 8.36,26.67 9.2,27.51 9.2,39.67 15.24,45.72 v15.24,48.26 | v13.44,53.34 12.7,53.34 11.43,52.07
  Top 0.813: PC1.+ 19.01,72.43 17.78,73.66 11.81,73.66 6.71,67.97 6.71,55.98 10.44,52.05 11.53,52.07 U1.3 | PC1.+ 19.05,71.12 21.59,73.66 83.82,73.66 85.09,72.39 85.09,60.88 CON1.VIN | D1.C 19.01,67.31 PC1.+
  Route2 0.406: v15.24,48.26 15.24,51.77 v13.44,53.34
  Route2 1.9: 85.15,61.28 CON1.VIN 85.15,59.38
  Route3 1.9: 85.15,61.28 CON1.VIN 85.15,59.38

### Text on the board
tPlace: PB7 | PB6 | PB5 | PB4 | PB3 | PB2 | PB1 | PB0 | NC | IOREF | RESET | 3.3V | 5V | GND | GND | VIN | A0 | A1 | A2 | A3 | A4 | A5 | + | + | + | + | 2.1mm | + | - | 7-20VDC | 5V | GND | GND | RESET2 | ON | TX | RX | L | GND | A7 | A6 | 5V | 16U2 | 328P | PC7 | PC6 | PC5 | PC4 | PC2 | PD7 | PD6 | PD5 | PD4 | PD3 | PD2 | PD1 | PD0 | SCL | SDA | AREF | GND | 13 | 12 | 11 | 10 | 9 | 8 | 7 | 6 | 5 | 4 | 3 | 2 | TX | RX | STEMTera Breadboard | v1.4 by JP Liew 2016
bPlace: + | - | 2.1mm | 7-20VDC | RESET